# Altium project NB3000AL.PRJPCB (part 1 of 3)
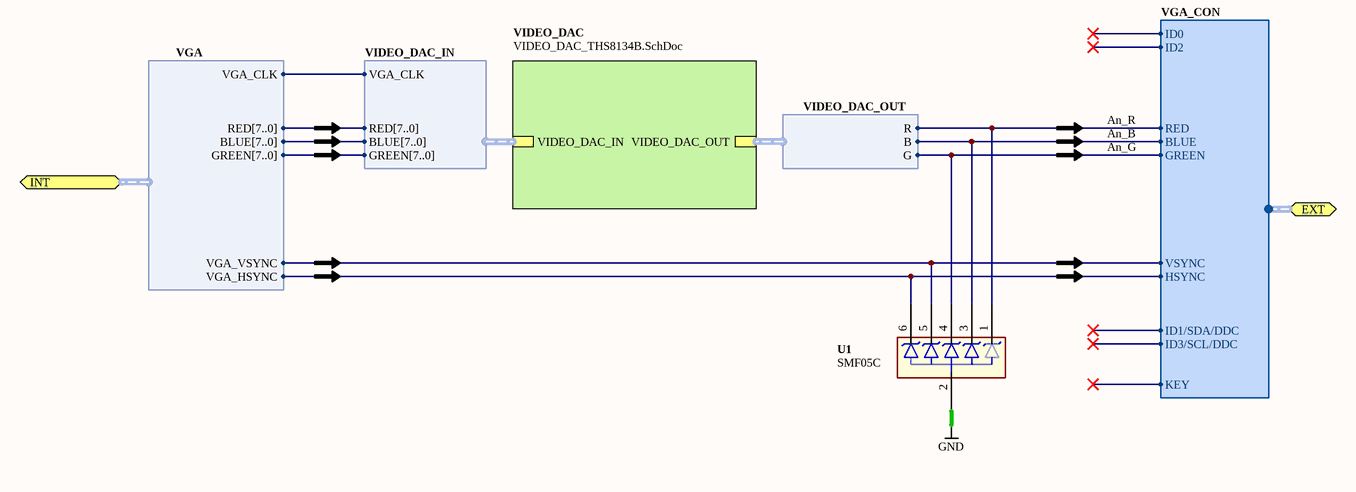
[diagram p0: VGA_OUT.SCHDOC]
ProjectAddress1: 3 Minna Close; ProjectAddress2: Belrose; ProjectAddress3: NSW 2085; ProjectAddress4: Australia; ProjectAssyNum: D-820-0053; ProjectOrganization: Altium Limited; ProjectRevision: 01; ProjectTitle: NB3000AL - Altera; ProjectTotalSheets: 106
22 sheets, 378 parts. Net scope: hierarchical (ports join the sheet entries above them; power ports are global).
Board files: NB3000AL.PcbDoc, NB3000AL_Panel.PcbDoc
Sheets:
  VGA_OUT.SCHDOC
  Audio_Codec.SchDoc
  PSU.SchDoc
  FPGA.SCHDOC
    USER_DECOUPLING_CAPS_3V3 = FPGA_Bypass_3V3.SCHDOC
    U_FPGA_Power = FPGA_NonIO.SchDoc
    PULLDOWN = PULLDNx3.SCHDOC
    PULLDOWN = PULLDNx3.SCHDOC
    PULLDOWN = PULLDNx3.SCHDOC
    PULLDOWN = PULLDNx3.SCHDOC
    PULLDOWN = PULLDNx3.SCHDOC
    PULLDOWN = PULLDNx3.SCHDOC
    PULLDOWN = PULLDNx3.SCHDOC
    PULLDOWN = PULLDNx3.SCHDOC
  LED_RGB_SMDx8.SCHDOC
    U_LED_01 = LED_RGB_SMDx2.SCHDOC
    U_LED_23 = LED_RGB_SMDx2.SCHDOC
    U_LED_45 = LED_RGB_SMDx2.SCHDOC
    U_LED_67 = LED_RGB_SMDx2.SCHDOC
  PWJACK+SWITCH.SchDoc
  HOST_JTAG.SchDoc
  USERPWR.SchDoc
  Host_FPGA.SchDoc
    HOST_NonIO = HOST_FPGA_NonIO.SchDoc
    HOST_DECOUPLING_CAPS_3V3 = FPGA_Bypass_3V3.SCHDOC
    PULLDOWN = PULLDNx3.SCHDOC
    PULLDOWN = PULLDNx3.SCHDOC
  USB_CY7C68001-56LFC.SchDoc
  OSC_24MHZ.SchDoc
  CON_AUDIO_AC99_NOMIC.SchDoc
  CON_FFC40_LCDTFT.SCHDOC
  Mounts.SchDoc
  PBCON.schdoc
  CON_SPDIF_INOUT_A.SchDoc
  USB_ISP1760.SchDoc

## Sheet VGA_OUT.SCHDOC: VGA Ouput
size A4; DocumentNumber: 2; PageSetup: Record=PageOptions|CenterHorizontal=True|CenterVertical=True|PrintScale=0.97|XCorrection=1.00|YCorrection=1.00|PrintKind=1|BorderSize=5000000|LeftOffset=0|BottomOffset=0|Orientation=2|PaperLength=1000|PaperWidth=1000|Scale=100|PaperSource=7|PrintQuality=-4|MediaType=1|DitherType=10|PaperKind=A4 (210 x 297 mm)|PrintScaleMode=1

### Parts
(Parts that share a designator on the sheet are numbered #1, #2 ... from top to bottom, then left to right.)
U1#1  SMF05C  [SC70_6L]

### Sub-sheets
VIDEO_DAC = VIDEO_DAC_THS8134B.SchDoc (file not in this document): VIDEO_DAC_OUT (harness VIDEO_DAC_OUT), VIDEO_DAC_IN (harness VIDEO_DAC_IN)

### Ports
EXT (harness VGA_CON), INT (harness VGA)

### Harnesses
VIDEO_DAC_IN: RED[7..0], GREEN[7..0], BLUE[7..0], VGA_CLK
VIDEO_DAC_OUT: B, R, G
VGA: RED[7..0], GREEN[7..0], BLUE[7..0], VGA_CLK, VGA_VSYNC, VGA_HSYNC
VGA_CON: RED, GREEN, BLUE, VSYNC, HSYNC, KEY, ID2, ID3/SCL/DDC, ID1/SDA/DDC, ID0

### Nets
GND: U1#1.2
An_B: U1#1.3 ; sheet VIDEO_DAC/VIDEO_DAC_OUT.B, port EXT.BLUE
An_G: U1#1.4 ; sheet VIDEO_DAC/VIDEO_DAC_OUT.G, port EXT.GREEN
An_R: U1#1.1 ; sheet VIDEO_DAC/VIDEO_DAC_OUT.R, port EXT.RED
NetU1#1_5: U1#1.5 ; port INT.VGA_VSYNC, port EXT.VSYNC
NetU1#1_6: U1#1.6 ; port INT.VGA_HSYNC, port EXT.HSYNC
(unnamed): sheet VIDEO_DAC/VIDEO_DAC_IN.VGA_CLK, port INT.VGA_CLK

### Notes on the sheet
- Sheet Title
- Project Title
- Size:
- Date:
- A4
- Assy:
- Time:
- Revision:
- Sheet
- of
- File:

### Library data of the parts
U1#1 = D-157-0000: TVS Diode Array  For ESD and Latch-Up Protection; Junction Capacitance: 130 pF; Peak Pulse Current: 8 A; Peak Pulse Power: 100 W; Reverse Breakdown Voltage: 6 V; Status: Unreleased; Category: Diode-Protection

## Sheet Audio_Codec.SchDoc: Audio CODEC Top
size A4; DocumentNumber: 4
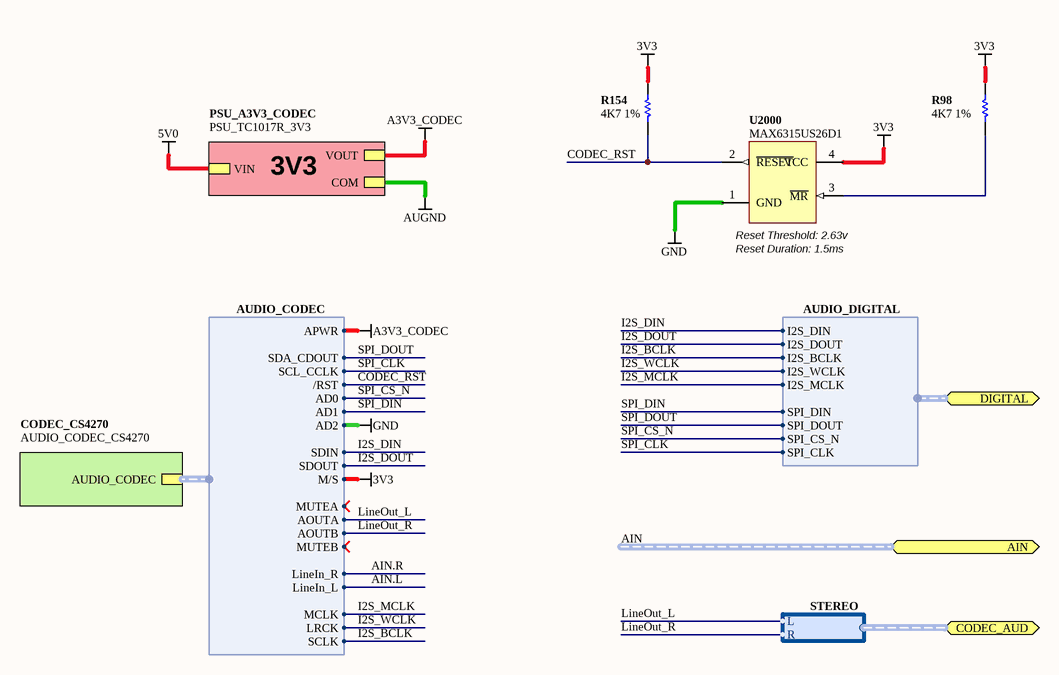
[diagram p1: Audio_Codec.SchDoc]

### Parts
(Parts that share a designator on the sheet are numbered #1, #2 ... from top to bottom, then left to right.)
R98  4K7 1%  [RESC1005-STAR]
R154#1  4K7 1%  [RESC1005-STAR]
U2000  MAX6315US26D1  [SOT143]

### Sub-sheets
CODEC_CS4270 = AUDIO_CODEC_CS4270 (file not in this document): AUDIO_CODEC (harness AUDIO_CODEC)
PSU_A3V3_CODEC = PSU_TC1017R_3V3 (file not in this document): VIN, VOUT, COM

### Ports
AIN (harness AUDIO_IN), CODEC_AUD (harness STEREO), DIGITAL (harness AUDIO_DIGITAL)

### Harnesses
AUDIO_CODEC: SDOUT, SDIN, SCLK, LRCK, MCLK, M/S, LineIn_L, LineIn_R, AOUTA, AOUTB, APWR, SCL_CCLK, AD1, SDA_CDOUT, AD0, AD2, /RST, MUTEA, MUTEB
AUDIO_DIGITAL: I2S_DOUT, I2S_DIN, I2S_BCLK, I2S_WCLK, I2S_MCLK, SPI_CLK, SPI_DIN, SPI_DOUT, SPI_CS_N
STEREO: L, R

### Nets
3V3: R98.2 R154#1.2 U2000.4(VCC) ; sheet CODEC_CS4270/AUDIO_CODEC.M/S
A3V3_CODEC: sheet PSU_A3V3_CODEC/VOUT, sheet CODEC_CS4270/AUDIO_CODEC.APWR
GND: U2000.1(GND) ; sheet CODEC_CS4270/AUDIO_CODEC.AD2
AIN.L: sheet CODEC_CS4270/AUDIO_CODEC.LineIn_L
AIN.R: sheet CODEC_CS4270/AUDIO_CODEC.LineIn_R
CODEC_RST: R154#1.1 U2000.2(~{RESET}) ; sheet CODEC_CS4270/AUDIO_CODEC./RST
I2S_BCLK: sheet CODEC_CS4270/AUDIO_CODEC.SCLK, port DIGITAL.I2S_BCLK
I2S_DIN: sheet CODEC_CS4270/AUDIO_CODEC.SDIN, port DIGITAL.I2S_DIN
I2S_DOUT: sheet CODEC_CS4270/AUDIO_CODEC.SDOUT, port DIGITAL.I2S_DOUT
I2S_MCLK: sheet CODEC_CS4270/AUDIO_CODEC.MCLK, port DIGITAL.I2S_MCLK
I2S_WCLK: sheet CODEC_CS4270/AUDIO_CODEC.LRCK, port DIGITAL.I2S_WCLK
LineOut_L: sheet CODEC_CS4270/AUDIO_CODEC.AOUTA, port CODEC_AUD.L
LineOut_R: sheet CODEC_CS4270/AUDIO_CODEC.AOUTB, port CODEC_AUD.R
SPI_CLK: sheet CODEC_CS4270/AUDIO_CODEC.SCL_CCLK, port DIGITAL.SPI_CLK
SPI_CS_N: sheet CODEC_CS4270/AUDIO_CODEC.AD0, port DIGITAL.SPI_CS_N
SPI_DIN: sheet CODEC_CS4270/AUDIO_CODEC.AD1, port DIGITAL.SPI_DIN
SPI_DOUT: sheet CODEC_CS4270/AUDIO_CODEC.SDA_CDOUT, port DIGITAL.SPI_DOUT
NetR98_1: R98.1 U2000.3(~{MR})

### Buses and harness runs
harness AIN = port AIN

### Notes on the sheet
- 3V3
- (near U2000) Reset Threshold: 2.63v
- (near U2000) Reset Duration: 1.5ms
- Sheet Title
- Project Title
- Size:
- Date:
- A4
- Assy:
- Time:
- Revision:
- Sheet
- of
- File:

### Library data of the parts
R98 R154#1 = D-100-0088: Resistor, 4K7 1% 0402 (1005); Power Rating: 63 mW; Resistance: 4.7 K; Category: Resistor; Mounting Technology: Surface Mount; Status: Production; Tolerance: 1 %
U2000 = D-243-0000: MAX6315, Open-Drain Output SOT Reset IC, Customized Reset Thresholds, Timeout Delays; Category: IC-Other; Status: Production

## Sheet PSU.SchDoc: NB3000 POWER SUPPLIES
size A4; Organization: Altium Limited.; DocumentNumber: 7; Revision: 6
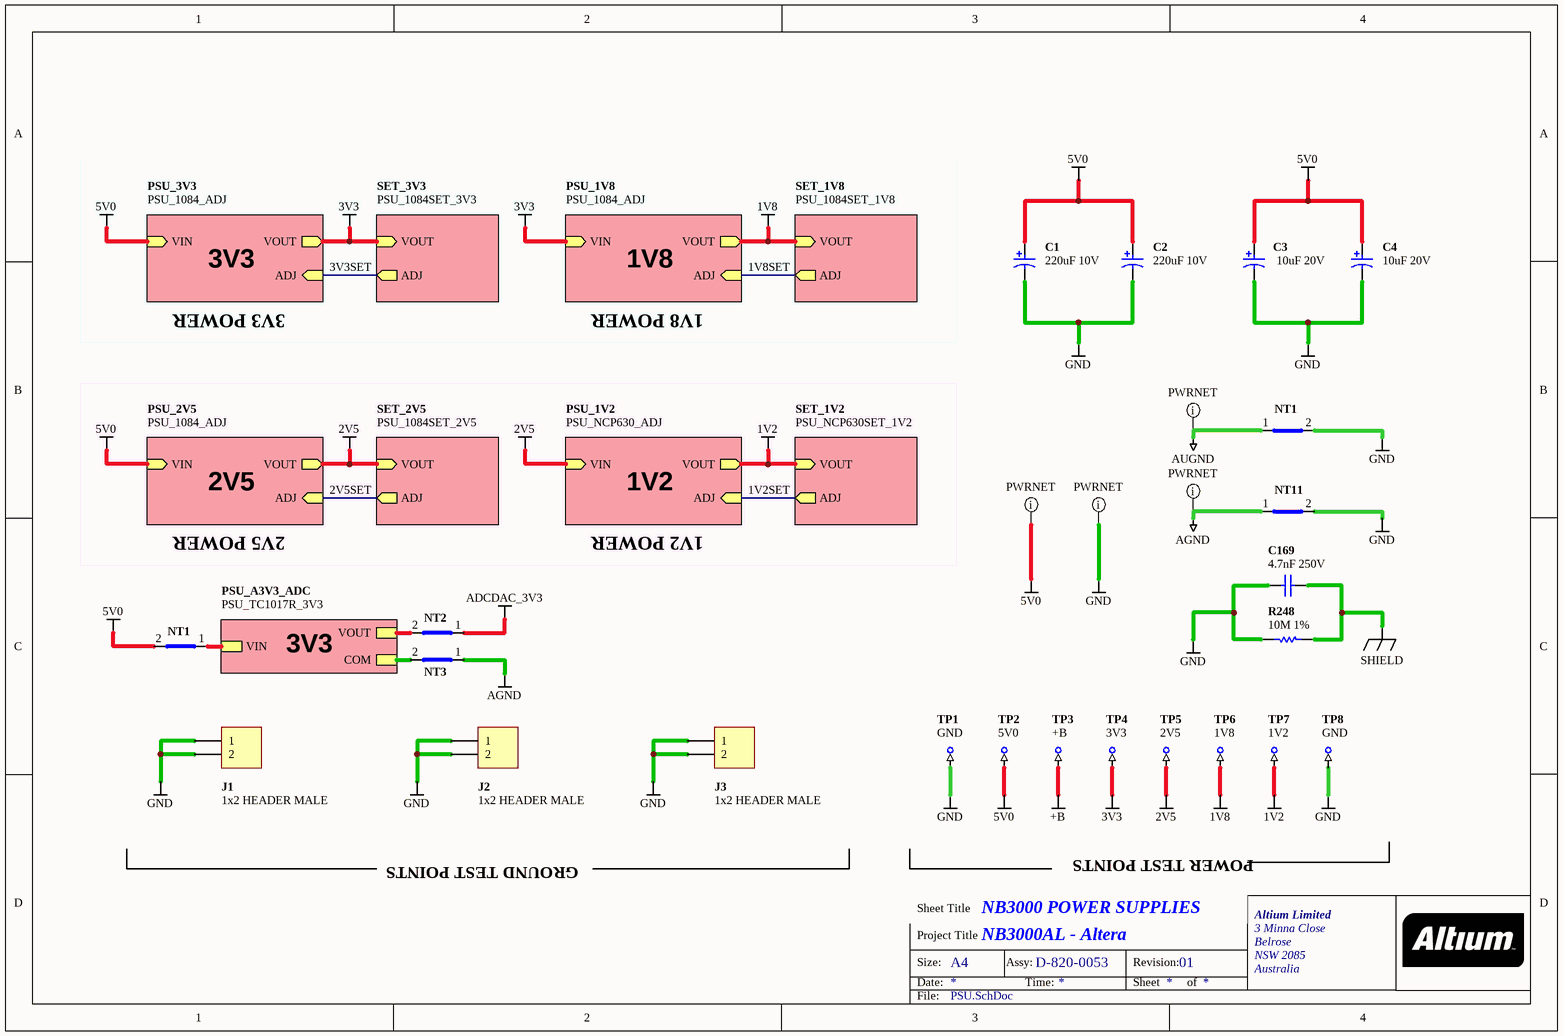
[diagram p2: PSU.SchDoc]

### Parts
(Parts that share a designator on the sheet are numbered #1, #2 ... from top to bottom, then left to right.)
C1#1  220uF 10V  [CAPC7343-STAR]
C2#1  220uF 10V  [CAPC7343-STAR]
C3#1  10uF 20V  [CAPC3528-STAR]
C4#1  10uF 20V  [CAPC3528-STAR]
C169  4.7nF 250V  [CAPM7163]
J1#1  1x2 HEADER MALE  [HDR1X2]
J2#1  1x2 HEADER MALE  [HDR1X2]
J3#1  1x2 HEADER MALE  [HDR1X2]
NT1#1  Net Tie SMT2  [NETTIE-SMT2-31X39]  (value not drawn)  (net tie, no BOM)
NT1#2  Net Tie SMT2  [NETTIE-SMT2-31X51]  (value not drawn)  (net tie, no BOM)
NT2#1  Net Tie SMT2  [NETTIE-SMT2-31X51]  (value not drawn)  (net tie, no BOM)
NT3#1  Net Tie SMT2  [NETTIE-SMT2-31X51]  (value not drawn)  (net tie, no BOM)
NT11  Net Tie SMT2  [NETTIE-SMT2-8X8]  (value not drawn)  (net tie, no BOM)
R248  10M 1%  [RESC3216]
TP1  GND  [TestPin]  (no BOM)
TP2  5V0  [TestPin]  (no BOM)
TP3  +B  [TestPin]  (no BOM)
TP4  3V3  [TestPin]  (no BOM)
TP5  2V5  [TestPin]  (no BOM)
TP6  1V8  [TestPin]  (no BOM)
TP7  1V2  [TestPin]  (no BOM)
TP8  GND  [TestPin]  (no BOM)

### Sub-sheets
PSU_1V2 = PSU_NCP630_ADJ (file not in this document): VIN (in), VOUT (out), ADJ (in)
PSU_1V8 = PSU_1084_ADJ (file not in this document): VIN (in), VOUT (out), ADJ (in)
PSU_2V5 = PSU_1084_ADJ (file not in this document): VIN (in), VOUT (out), ADJ (in)
PSU_3V3 = PSU_1084_ADJ (file not in this document): VIN (in), VOUT (out), ADJ (in)
PSU_A3V3_ADC = PSU_TC1017R_3V3 (file not in this document): VIN, VOUT, COM
SET_1V2 = PSU_NCP630SET_1V2 (file not in this document): VOUT (in), ADJ (out)
SET_1V8 = PSU_1084SET_1V8 (file not in this document): VOUT (in), ADJ (out)
SET_2V5 = PSU_1084SET_2V5 (file not in this document): VOUT (in), ADJ (out)
SET_3V3 = PSU_1084SET_3V3 (file not in this document): VOUT (in), ADJ (out)

### Nets
1V2: TP7.1 ; sheet PSU_1V2/VOUT, sheet SET_1V2/VOUT
1V8: TP6.1 ; sheet PSU_1V8/VOUT, sheet SET_1V8/VOUT
2V5: TP5.1 ; sheet PSU_1V2/VIN, sheet PSU_2V5/VOUT, sheet SET_2V5/VOUT
3V3: TP4.1 ; sheet PSU_1V8/VIN, sheet PSU_3V3/VOUT, sheet SET_3V3/VOUT
5V0: C1#1.1 C2#1.1 C3#1.1 C4#1.1 NT1#2.2(Net2) TP2.1 ; sheet PSU_2V5/VIN, sheet PSU_3V3/VIN
+B: TP3.1
ADCDAC_3V3: NT2#1.1(Net1)
AGND: NT3#1.1(Net1) NT11.1(Net1)
AUGND: NT1#1.1(Net1)
GND: C1#1.2 C2#1.2 C3#1.2 C4#1.2 C169.2 J1#1.1 J1#1.2 J2#1.1 J2#1.2 J3#1.1 J3#1.2 NT1#1.2(Net2) NT11.2(Net2) R248.2 TP1.1 TP8.1
SHIELD: C169.1 R248.1
1V2SET: sheet PSU_1V2/ADJ, sheet SET_1V2/ADJ
1V8SET: sheet PSU_1V8/ADJ, sheet SET_1V8/ADJ
2V5SET: sheet PSU_2V5/ADJ, sheet SET_2V5/ADJ
3V3SET: sheet PSU_3V3/ADJ, sheet SET_3V3/ADJ
NetNT1#2_1: NT1#2.1(Net1) ; sheet PSU_A3V3_ADC/VIN
NetNT2#1_2: NT2#1.2(Net2) ; sheet PSU_A3V3_ADC/VOUT
NetNT3#1_2: NT3#1.2(Net2) ; sheet PSU_A3V3_ADC/COM

### Layout directives
net class PWRNET: 5V0, AGND, AUGND, GND

### Notes on the sheet
- 3V3
- 3V3 POWER
- 1V8
- 1V8 POWER
- 2V5
- 1V2
- 2V5 POWER
- 1V2 POWER
- POWER TEST POINTS
- GROUND TEST POINTS
- Sheet Title
- Project Title
- Size:
- Date:
- A4
- Assy:
- Time:
- Revision:
- Sheet
- of
- File:

### Library data of the parts
C1#1 C2#1 = D-101-0088: Capacitor, Tantalum, 220uF 10% 10V MCCT-D (7343-31); Polarity: Polarized; Category: Capacitor; Capacitance: 220 uF; Mounting Technology: Surface Mount; Rated Voltage: 10 V; Status: Unreleased; Technology: Tantalum; Tolerance: 10 %
C3#1 C4#1 = D-101-0007: Capacitor, Tantalum, 10uF 10% 20V MCCT-B (3528); Polarity: Polarized; Category: Capacitor; Status: Production; Capacitance: 10 uF; Mounting Technology: Surface Mount; Rated Voltage: 20 V; Technology: Tantalum; Tolerance: 10 %
C169 = D-101-0019: Capacitor, Ceramic, 4.7nF 20% 250V Panasonic BC J Lead (CAPM7163) Y5V; Polarity: Non-Polarized; Tolerance: 20% %; Category: Capacitor; Capacitance: 4.7 nF; Dielectric: Y5V; Mounting Technology: Surface Mount; Rated Voltage: 250 V; Status: Production; Technology: Ceramic
J1#1 J2#1 J3#1 = D-300-0020: Header IDC, 2 x 1 Pin Vertical 2.54mm Pitch (Non-Boxed, Male); Max Current: 3 A; Category: Connector; Connector type: Header; Mounting Technology: Through-Hole; Pin Count: 2; Status: Production
NT1#1 NT11 = D-002-0004: Net-Tie, Surface Mount, 2 x 2.0mm x 0.8mm SMT Pads - For 0.8mm Track; Status: Production; Category: Net-Tie
NT1#2 NT2#1 NT3#1 = D-002-0003: Net-Tie, Surface Mount, 2 x 1.6mm x 0.8mm SMT Pads - For 0.8mm Track; Category: Net-Tie; Status: Production
R248 = D-100-0059: Resistor, 10M 1%1206 (3216); Power Rating: 250 mW; Category: Resistor; Mounting Technology: Surface Mount; Resistance: 10 M; Status: Deprecated; Tolerance: 1 %
TP1-TP8 = D-006-0000: Test Point, PCB Mount with Silkscreen Box; Category: Test-Point; Status: Production

## Sheet FPGA.SCHDOC: USER FPGA Connections
size A0; Organization: Altium Limited.; PageSetup: Record=PageOptions|CenterHorizontal=True|CenterVertical=True|PrintScale=0.50|XCorrection=1.00|YCorrection=1.00|PrintKind=0|BorderSize=5000000|LeftOffset=0|BottomOffset=0|Orientation=2|PaperLength=4199|PaperWidth=2969|Scale=100|PaperSource=7|PrintQuality=600|MediaType=1|DitherType=10|PaperKind=A3 (297 x 420 mm)|PrintScaleMode=1
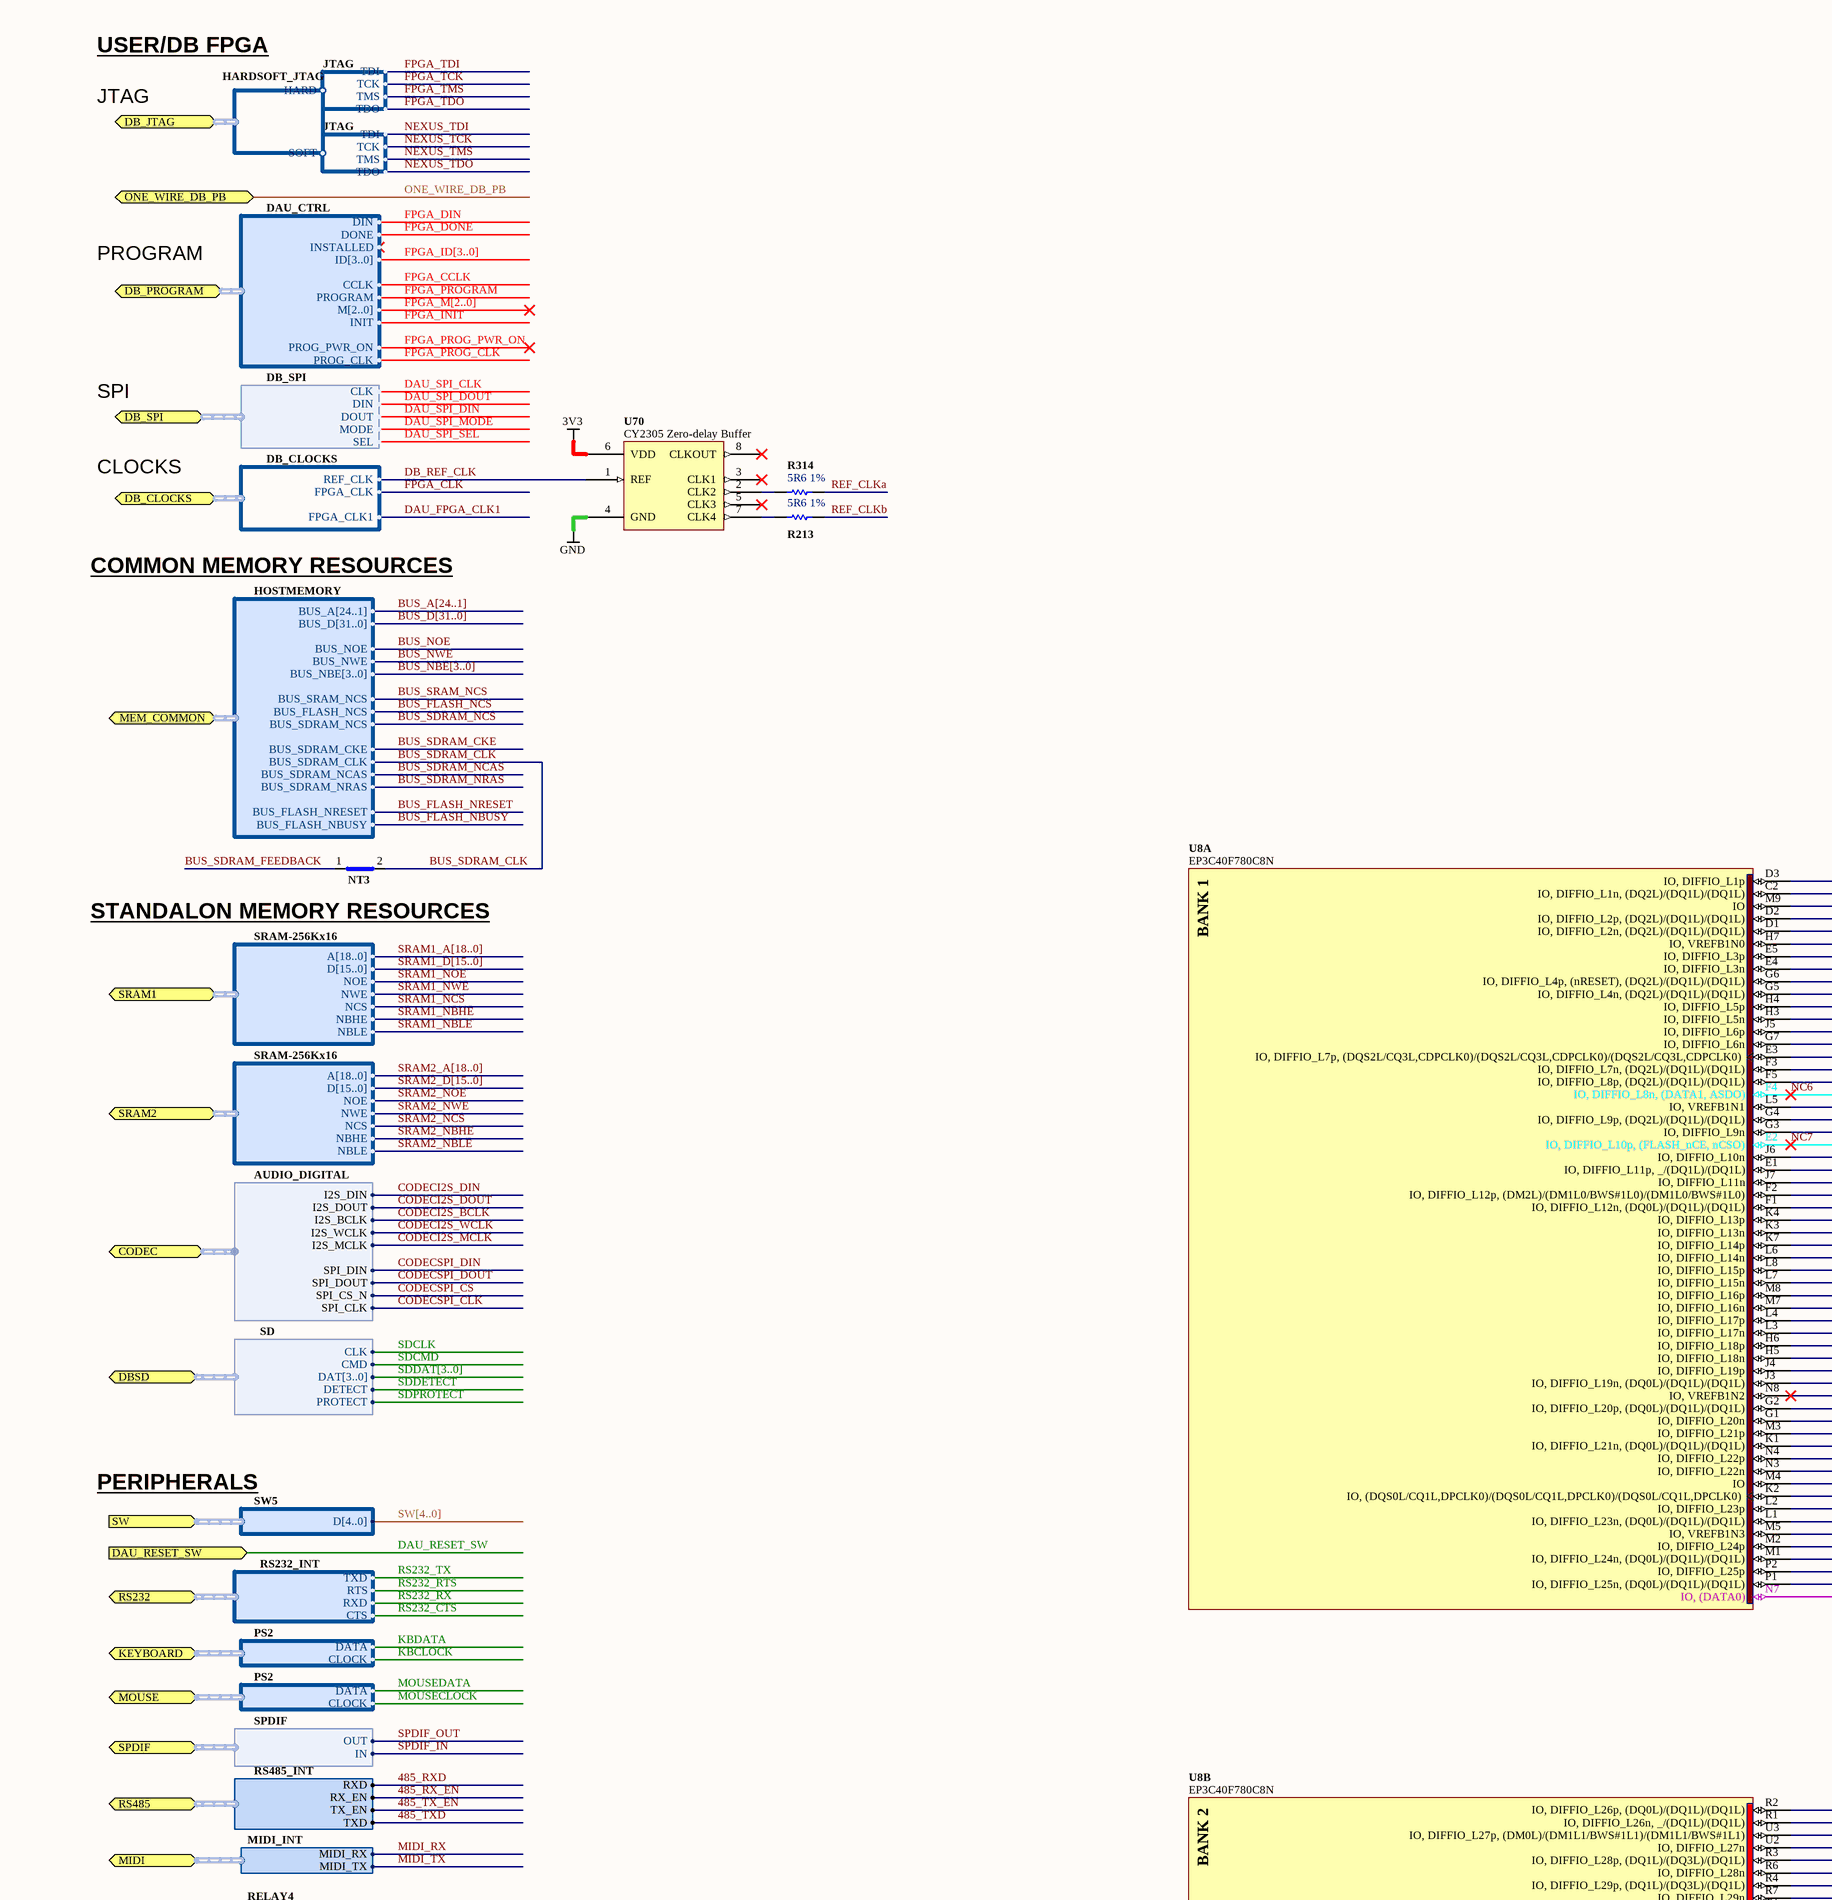
[diagram p3: FPGA.SCHDOC, top left]
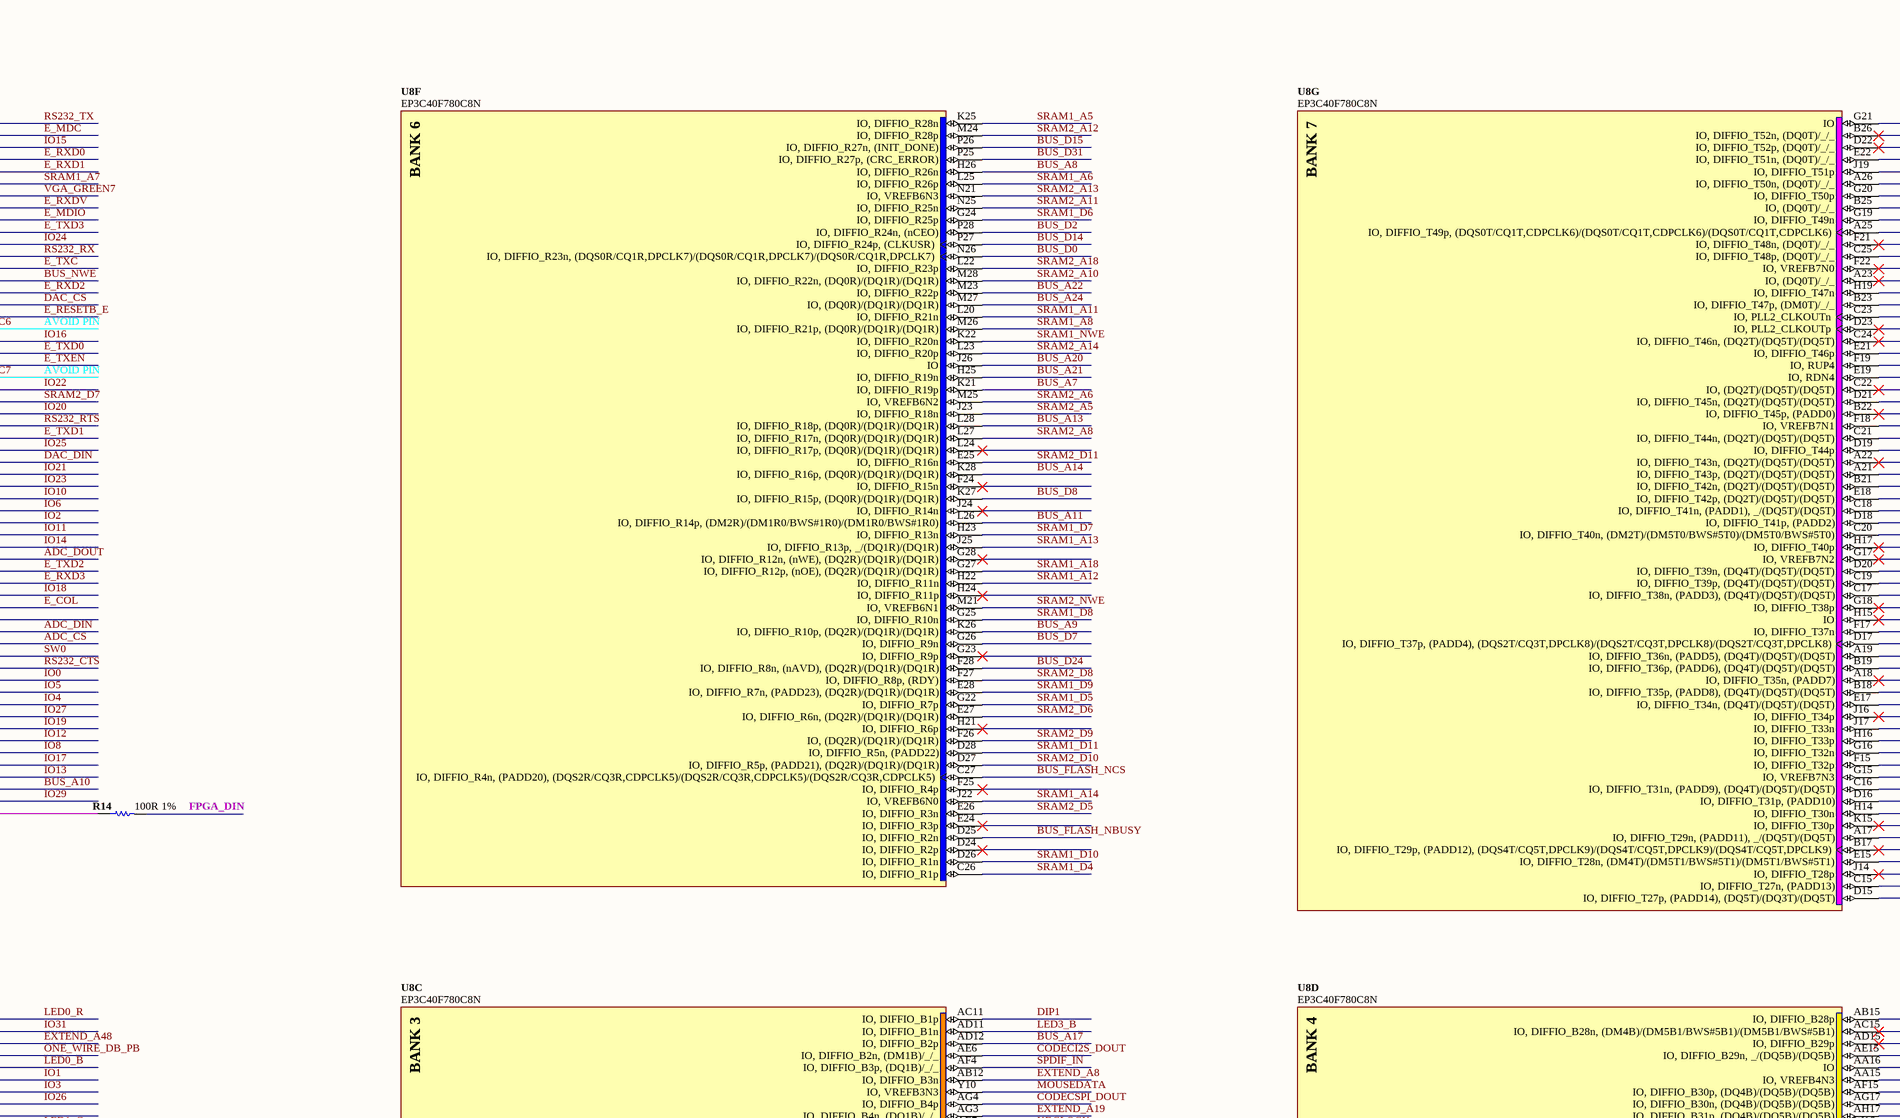
[diagram p4: FPGA.SCHDOC, top middle]
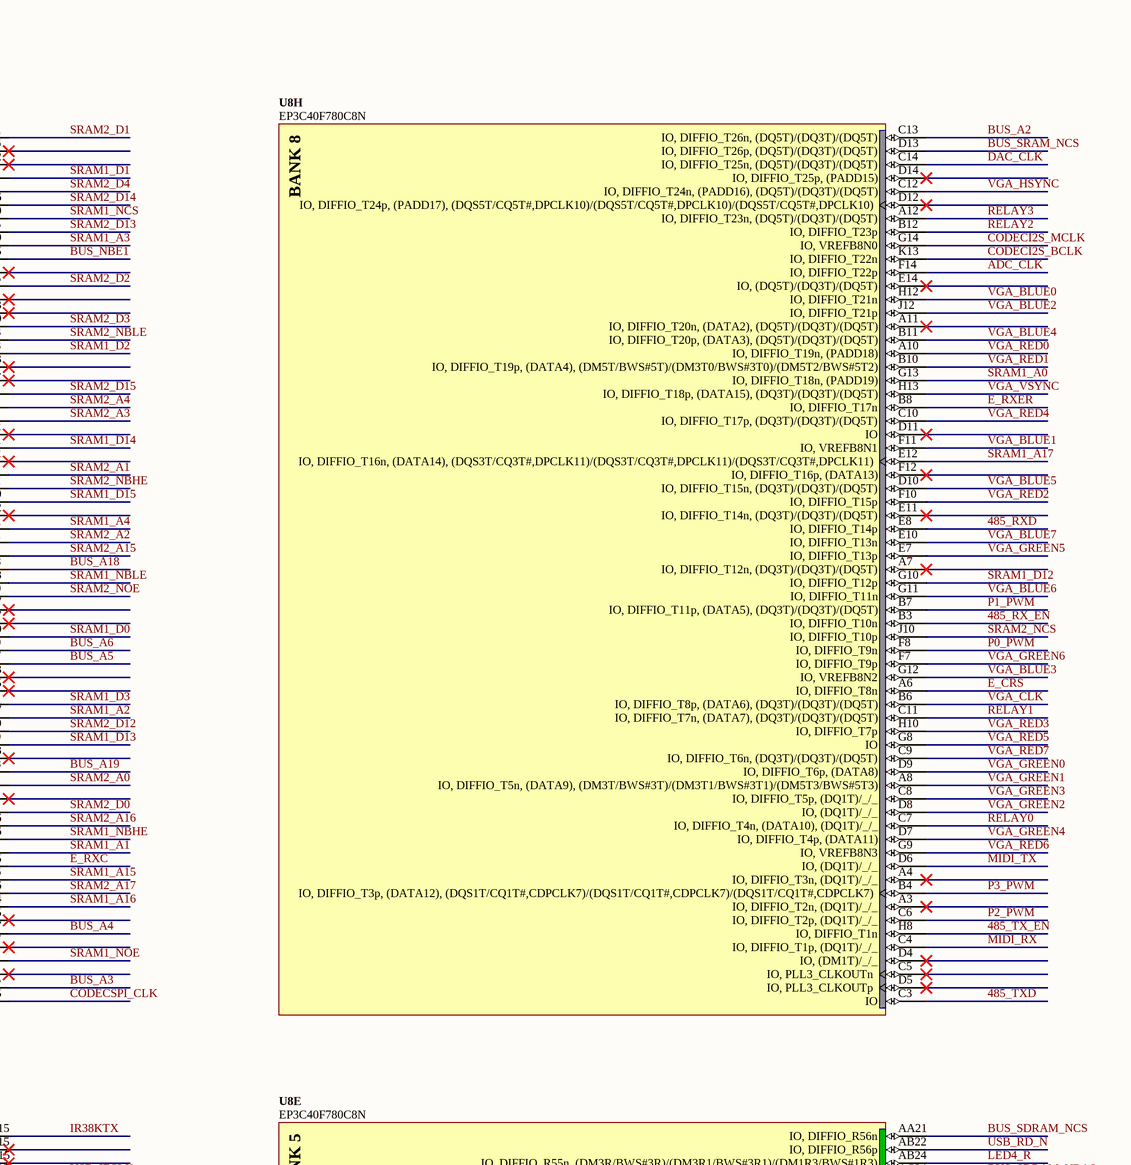
[diagram p5: FPGA.SCHDOC, top right]
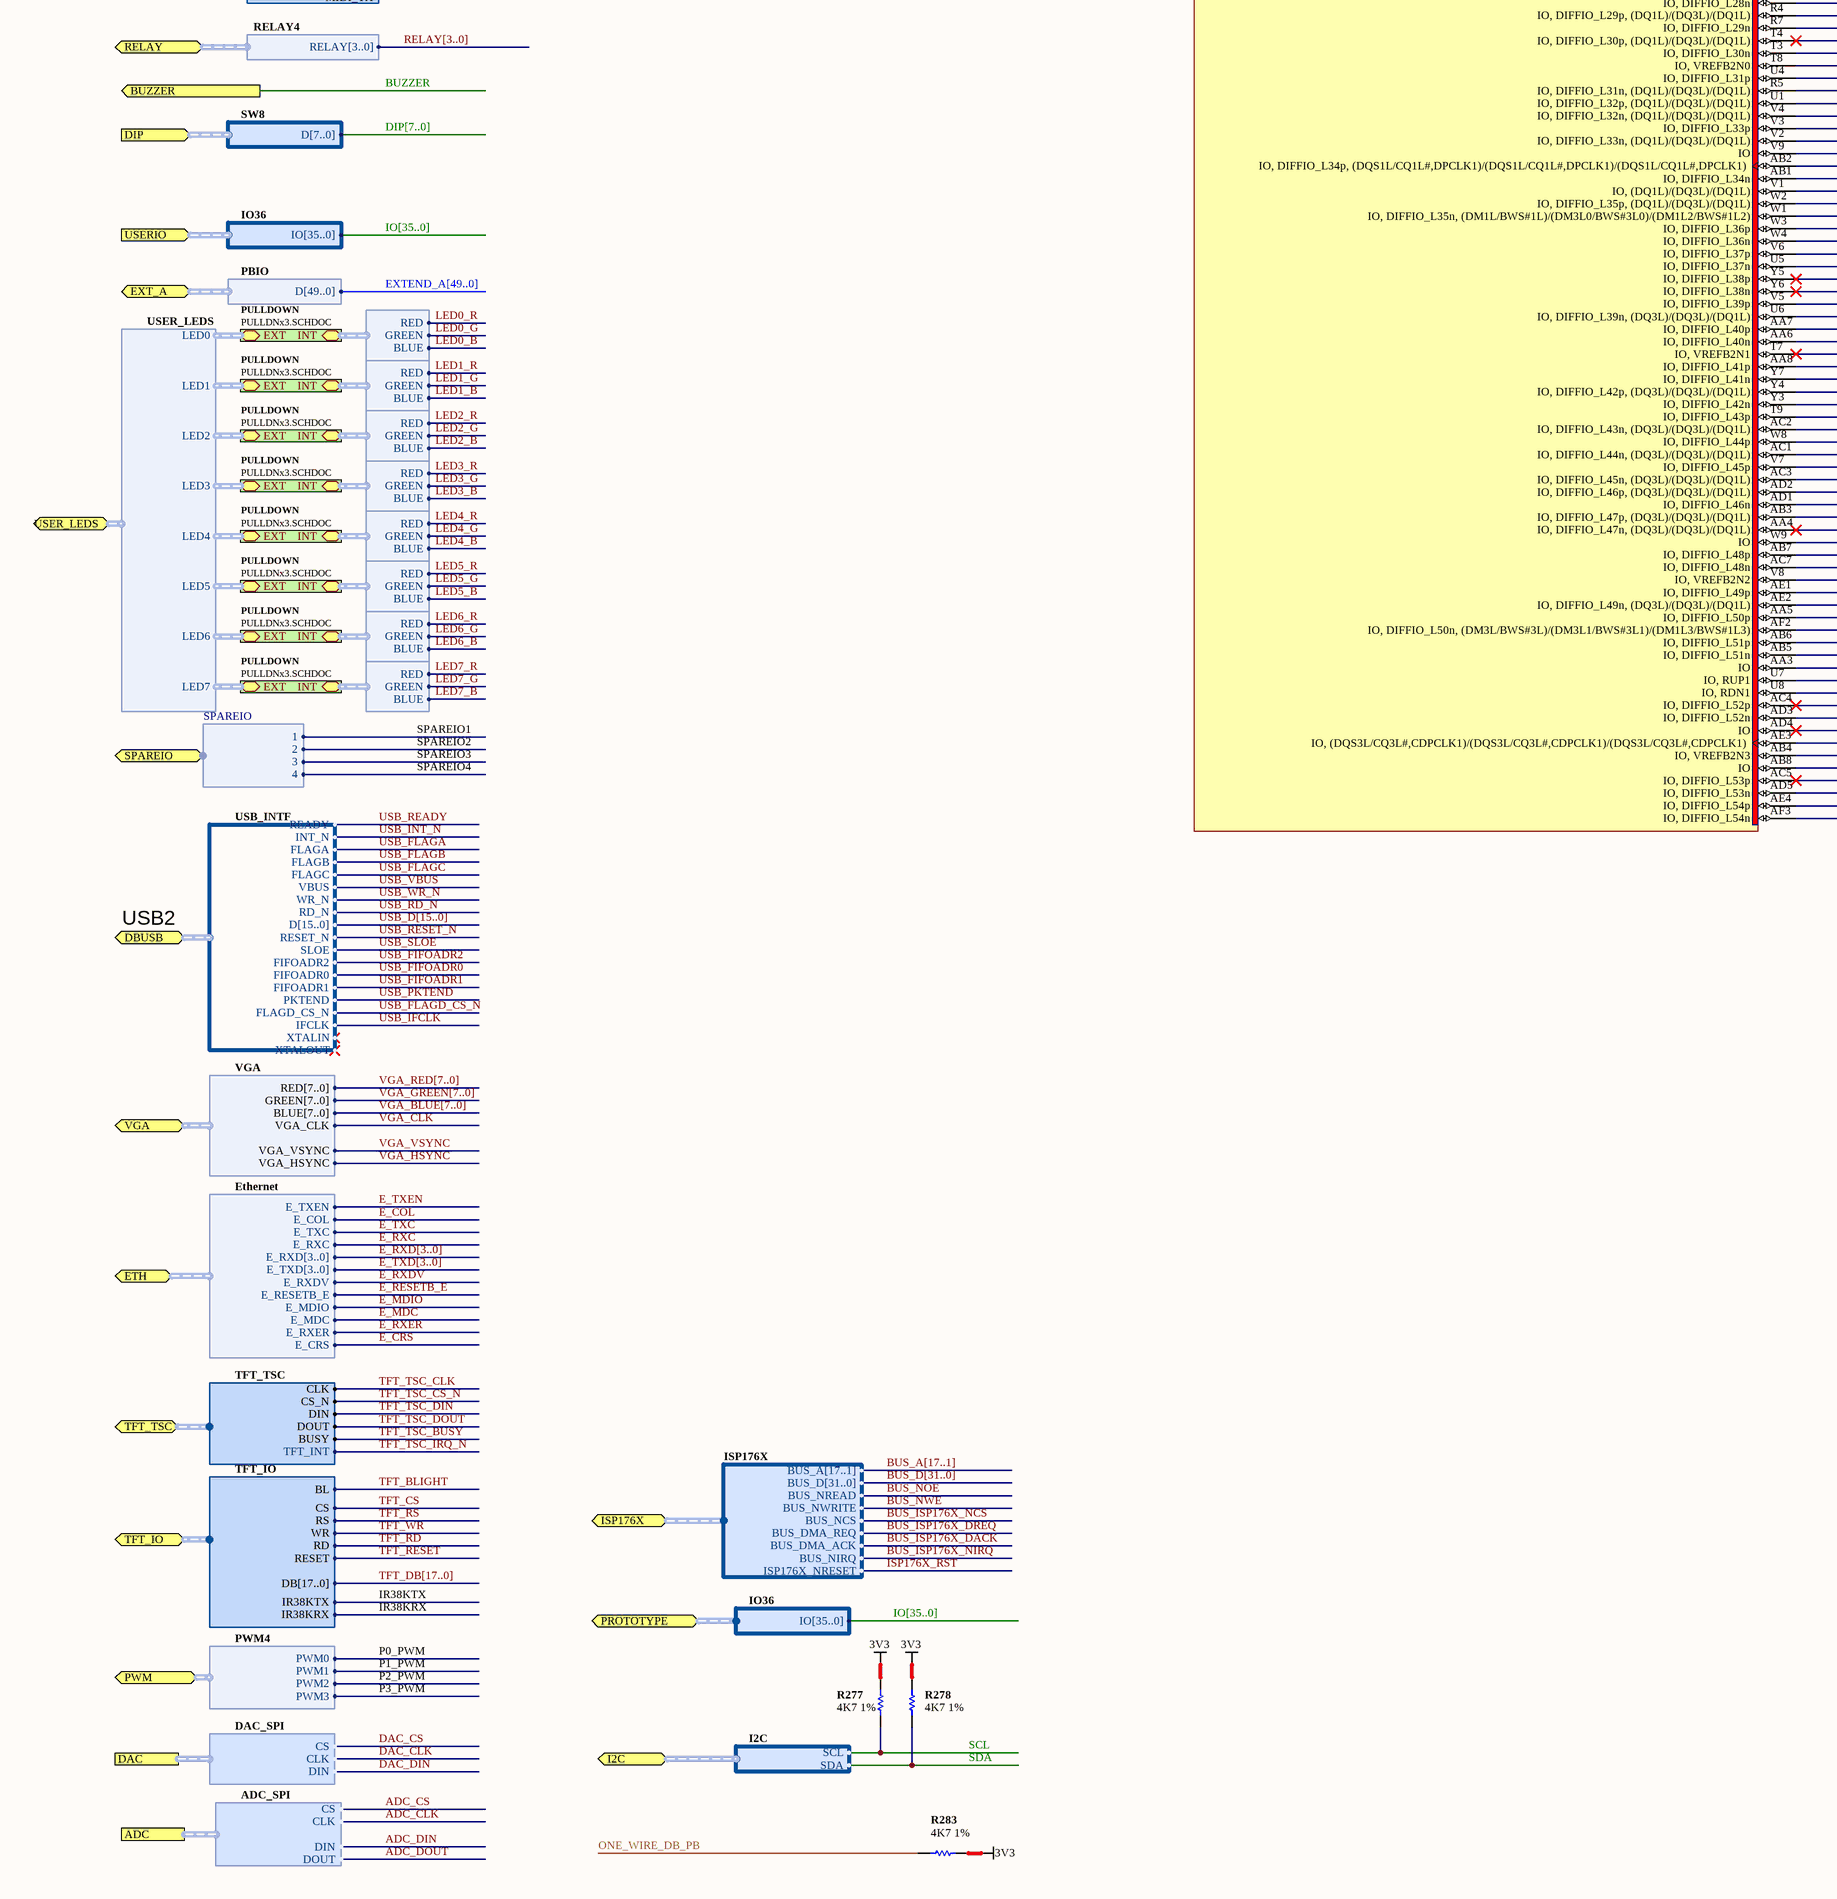
[diagram p6: FPGA.SCHDOC, bottom left]
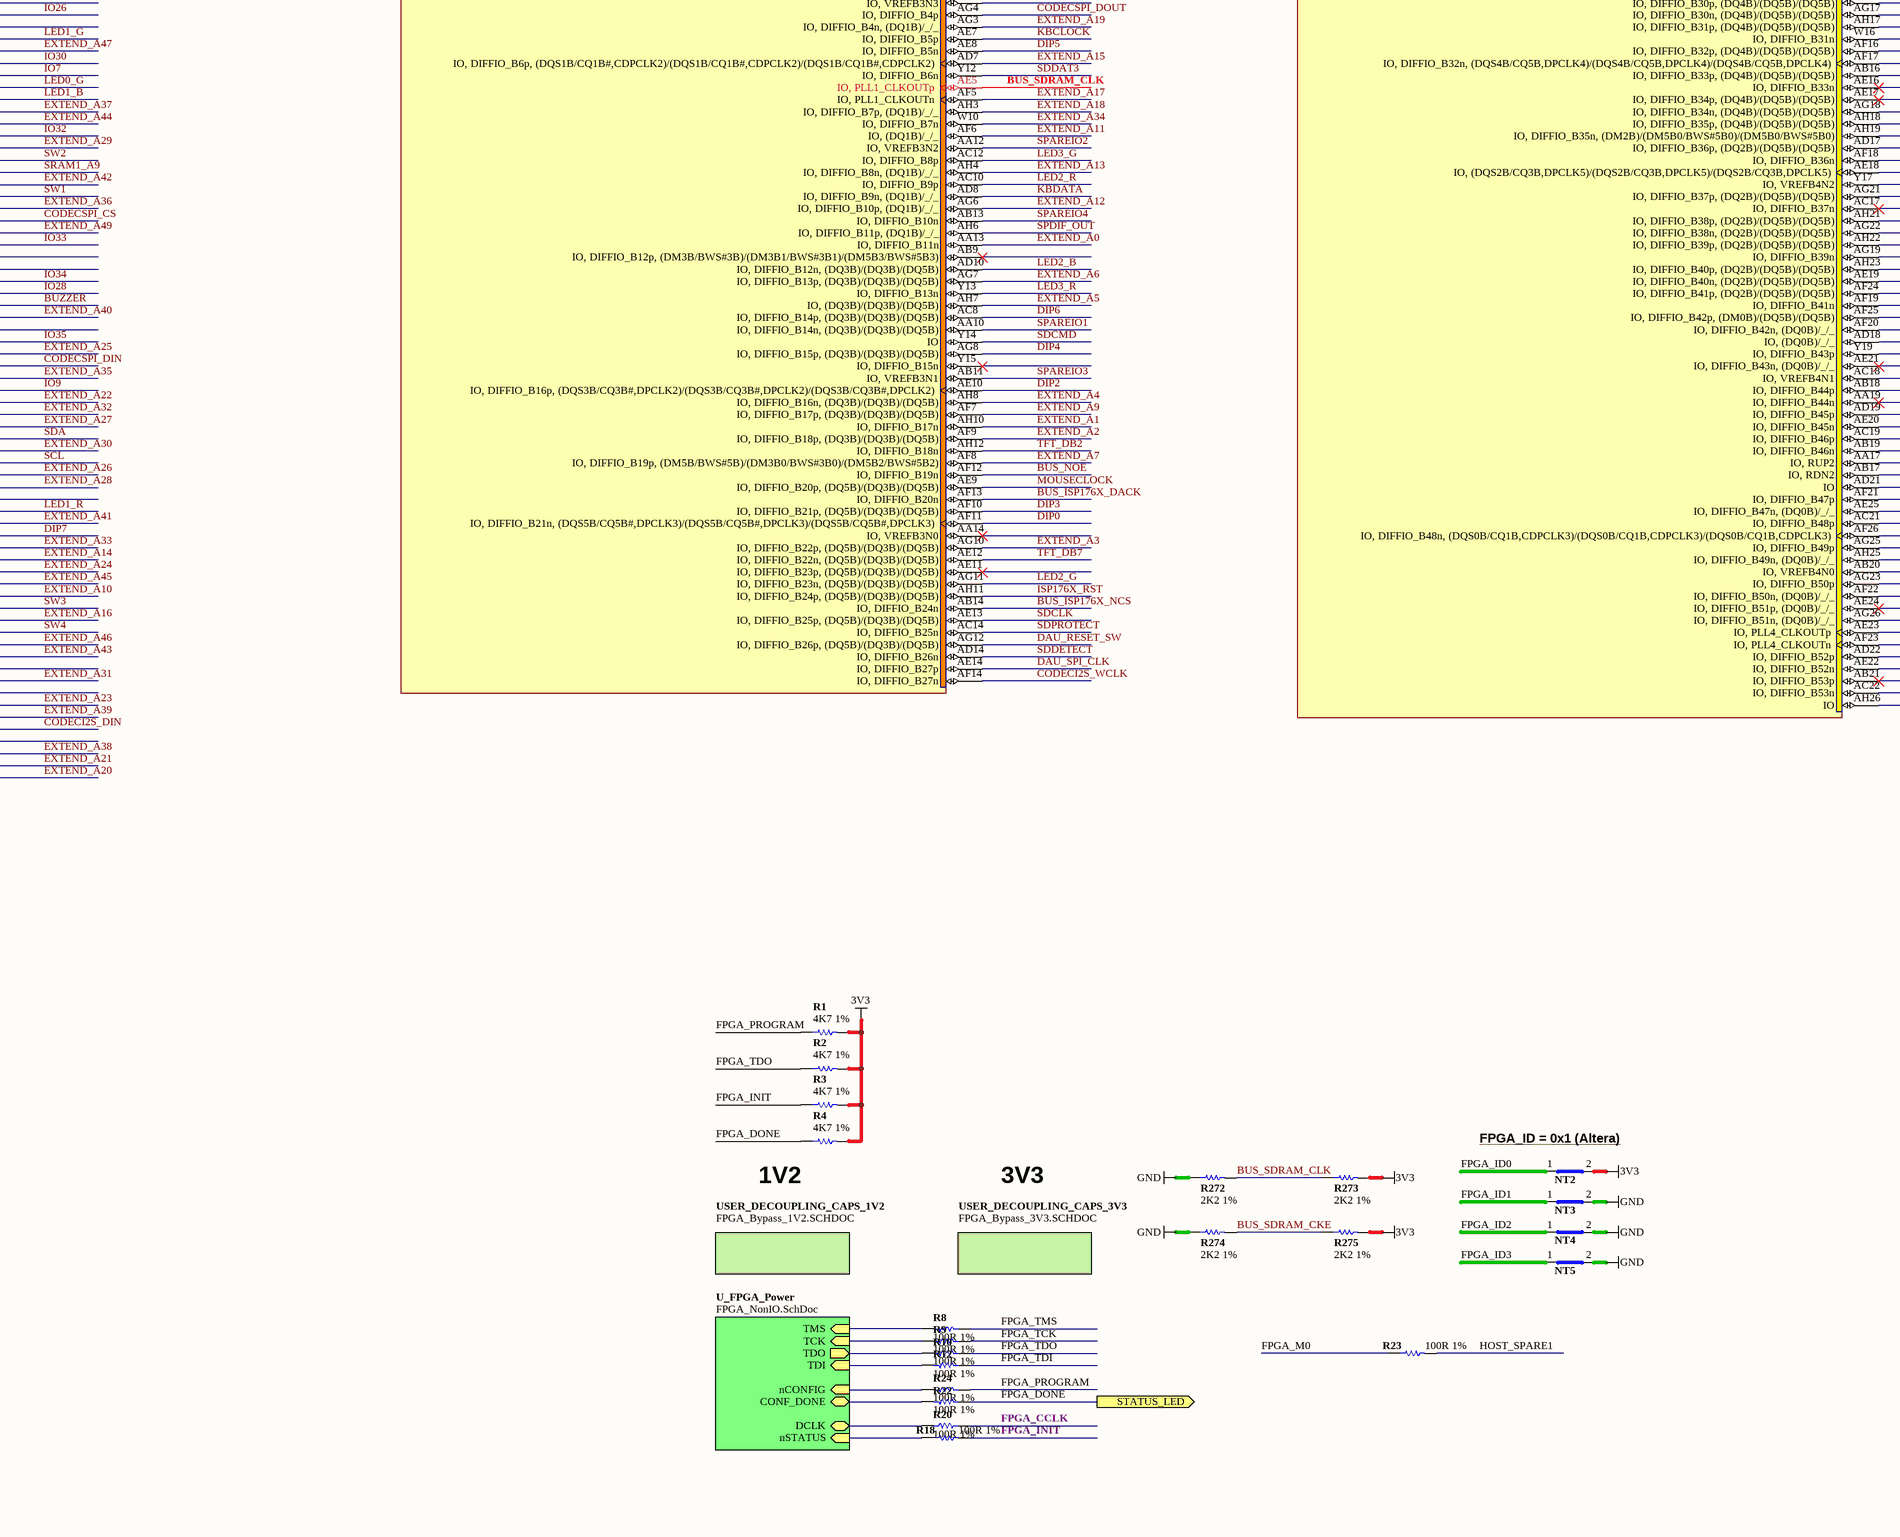
[diagram p7: FPGA.SCHDOC, bottom middle]
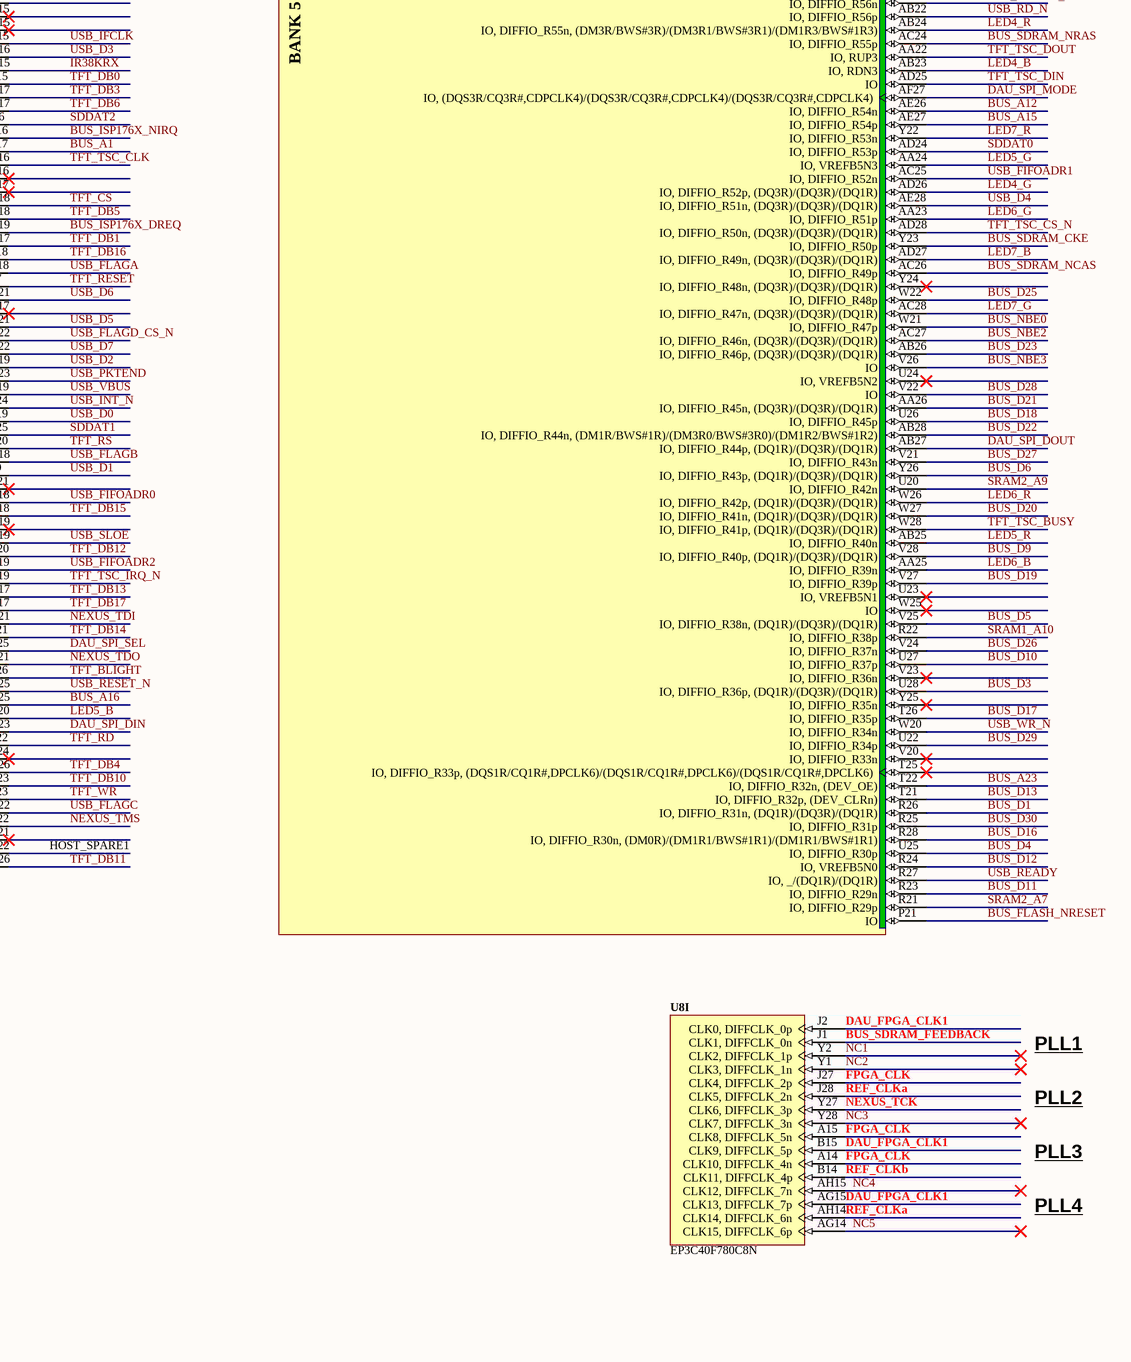
[diagram p8: FPGA.SCHDOC, bottom right]

### Parts
(Parts that share a designator on the sheet are numbered #1, #2 ... from top to bottom, then left to right.)
NT2#2  Net Tie SMT2  [NETTIE-SMT2-8X8]  (value not drawn)  (net tie, no BOM)
NT3#2  Net Tie SMT2  [NETTIE-SMT2-8X8]  (value not drawn)  (net tie, no BOM)
NT3#3  Net Tie SMT2  [NETTIE-SMT2-8X8]  (value not drawn)  (net tie, no BOM)
NT4  Net Tie SMT2  [NETTIE-SMT2-8X8]  (value not drawn)  (net tie, no BOM)
NT5  Net Tie SMT2  [NETTIE-SMT2-8X8]  (value not drawn)  (net tie, no BOM)
R1#1  4K7 1%  [RESC1005-STAR]
R2#1  4K7 1%  [RESC1005-STAR]
R3#1  4K7 1%  [RESC1005-STAR]
R4#1  4K7 1%  [RESC1005-STAR]
R8#1  100R 1%  [RESC1005-STAR]
R9#1  100R 1%  [RESC1005-STAR]
R10  100R 1%  [RESC1005-STAR]
R12  100R 1%  [RESC1005-STAR]
R14  100R 1%  [RESC1005-STAR]
R18  100R 1%  [RESC1005-STAR]
R20  100R 1%  [RESC1005-STAR]
R22  100R 1%  [RESC1005-STAR]
R23  100R 1%  [RESC1005-STAR]
R24  100R 1%  [RESC1005-STAR]
R213  5R6 1%  [RESC1005-STAR]
R272  2K2 1%  [RESC1005-STAR]
R273  2K2 1%  [RESC1005-STAR]
R274  2K2 1%  [RESC1005-STAR]
R275  2K2 1%  [RESC1005-STAR]
R277  4K7 1%  [RESC1005-STAR]
R278  4K7 1%  [RESC1005-STAR]
R283  4K7 1%  [RESC1005-STAR]
R314  5R6 1%  [RESC1005-STAR]
U8  EP3C40F780C8N  [FBGA780-2]  (parts A,B,C,D,E,F,G,H,I of 13)
U70  CY2305 Zero-delay Buffer  [SOIC127P600-8]

### Sub-sheets
PULLDOWN = PULLDNx3.SCHDOC: EXT, INT (harness RGB_LED)
PULLDOWN = PULLDNx3.SCHDOC: EXT, INT (harness RGB_LED)
PULLDOWN = PULLDNx3.SCHDOC: EXT, INT (harness RGB_LED)
PULLDOWN = PULLDNx3.SCHDOC: EXT, INT (harness RGB_LED)
PULLDOWN = PULLDNx3.SCHDOC: EXT, INT (harness RGB_LED)
PULLDOWN = PULLDNx3.SCHDOC: EXT, INT (harness RGB_LED)
PULLDOWN = PULLDNx3.SCHDOC: EXT, INT (harness RGB_LED)
PULLDOWN = PULLDNx3.SCHDOC: EXT, INT (harness RGB_LED)
U_FPGA_Power = FPGA_NonIO.SchDoc: TMS (in), CONF_DONE (bidir), DCLK (bidir), TCK (in), nSTATUS (in), TDI (in), nCONFIG (in), TDO (out)
USER_DECOUPLING_CAPS_1V2 = FPGA_Bypass_1V2.SCHDOC (file not in this document): no entries
USER_DECOUPLING_CAPS_3V3 = FPGA_Bypass_3V3.SCHDOC: no entries

### Ports
ADC (harness ADC_SPI), BUZZER (out), CODEC (harness AUDIO_DIGITAL), DAC (harness DAC_SPI), DAU_RESET_SW (in), DB_CLOCKS (harness DB_CLOCKS), DB_JTAG (harness HARDSOFT_JTAG), DB_PROGRAM (harness DAU_CTRL), DB_SPI (harness DB_SPI), DBSD (harness SD), DBUSB (harness USB_INTF), DIP (harness SW8), ETH (harness Ethernet), EXT_A (harness PBIO), I2C (harness I2C), ISP176X (harness ISP176X), KEYBOARD (harness PS2), MEM_COMMON (harness HOSTMEMORY), MIDI (harness MIDI_INT), MOUSE (harness PS2), ONE_WIRE_DB_PB (bidir), PROTOTYPE (harness IO36), PWM (harness PWM4), RELAY (harness RELAY4), RS232 (harness RS232_INT), RS485 (harness RS485_INT), SPAREIO (harness SPAREIO), SPDIF (harness SPDIF), SRAM1 (harness SRAM-256Kx16), SRAM2 (harness SRAM-256Kx16), STATUS_LED (out), SW (harness SW5), TFT_IO (harness TFT_IO), TFT_TSC (harness TFT_TSC), USER_LEDS (harness USER_LEDS), USERIO (harness IO36), VGA (harness VGA)

### Harnesses
SRAM-256Kx16: A[18..0], D[15..0], NCS, NWE, NOE, NBHE, NBLE
HOSTMEMORY: BUS_A[24..1], BUS_D[31..0], BUS_NOE, BUS_NWE, BUS_NBE[3..0], BUS_SRAM_NCS, BUS_FLASH_NCS, BUS_SDRAM_NCS, BUS_SDRAM_CKE, BUS_SDRAM_CLK, BUS_SDRAM_NCAS, BUS_SDRAM_NRAS, BUS_FLASH_NRESET, BUS_FLASH_NBUSY
DAU_CTRL: DIN, DONE, INSTALLED, ID[3..0], CCLK, PROGRAM, M[2..0], INIT, PROG_PWR_ON, PROG_CLK
SW5: D[4..0]
PS2: DATA, CLOCK
RS232_INT: RXD, TXD, RTS, CTS
IO36: IO[35..0]
I2C: SCL, SDA
RGB_LED: GREEN, RED, BLUE
AUDIO_DIGITAL: I2S_DOUT, I2S_DIN, I2S_BCLK, I2S_WCLK, I2S_MCLK, SPI_CLK, SPI_DIN, SPI_DOUT, SPI_CS_N
SW8: D[7..0]
SD: CLK, CMD, DAT[3..0], DETECT, PROTECT
Ethernet: E_RXC, E_TXC, E_TXD[3..0], E_TXEN, E_COL, E_RXD[3..0], E_RXDV, E_RESETB_E, E_MDIO, E_MDC, E_RXER, E_CRS
SPDIF: IN, OUT
VGA: RED[7..0], GREEN[7..0], BLUE[7..0], VGA_CLK, VGA_VSYNC, VGA_HSYNC
RELAY4: RELAY[3..0]
ADC_SPI: CS, CLK, DIN, DOUT
DAC_SPI: CS, CLK, DIN
MIDI_INT: MIDI_TX, MIDI_RX
JTAG: TMS, TDO, TDI, TCK
HARDSOFT_JTAG: HARD, SOFT
DB_CLOCKS: REF_CLK, FPGA_CLK, FPGA_CLK1
PWM4: PWM0, PWM1, PWM2, PWM3
RS485_INT: TX_EN, RXD, RX_EN, TXD
DB_SPI: MODE, SEL, CLK, DIN, DOUT
TFT_IO: CS, RS, WR, RD, RESET, DB[17..0], BL, IR38KTX, IR38KRX
USER_LEDS: LED0, LED1, LED2, LED3, LED4, LED5, LED6, LED7
PBIO: D[49..0]
USB_INTF: READY, INT_N, SLOE, FIFOADR2, FIFOADR0, FIFOADR1, PKTEND, FLAGD_CS_N, FLAGA, FLAGB, FLAGC, WR_N, RD_N, D[15..0], RESET_N, IFCLK, XTALIN, VBUS, XTALOUT
ISP176X: BUS_A[17..1], BUS_D[31..0], BUS_NREAD, BUS_NCS, BUS_DMA_REQ, BUS_DMA_ACK, BUS_NIRQ, BUS_NWRITE, ISP176X_NRESET
SPAREIO: 1, 2, 3, 4
TFT_TSC: CLK, CS_N, DIN, DOUT, BUSY, TFT_INT

### Nets
3V3: NT2#2.2(Net2) R1#1.2 R2#1.2 R3#1.2 R4#1.2 R273.2 R275.2 R277.1 R278.2 R283.1 U70.6(VDD)
GND: NT3#3.2(Net2) NT4.2(Net2) NT5.2(Net2) R272.1 R274.1 U70.4(GND)
485_RX_EN: U8.B3(IO,_DIFFIO_T10n) ; port RS485.RX_EN
485_RXD: U8.E8(IO,_DIFFIO_T14p) ; port RS485.RXD
485_TX_EN: U8.H8(IO,_DIFFIO_T1n) ; port RS485.TX_EN
485_TXD: U8.C3(IO) ; port RS485.TXD
ADC_CLK: U8.F14(IO,_DIFFIO_T22p) ; port ADC.CLK
ADC_CS: U8.G1(IO,_DIFFIO_L20n) ; port ADC.CS
ADC_DIN: U8.G2(IO,_DIFFIO_L20p,_(DQ0L)/(DQ1L)/(DQ1L)) ; port ADC.DIN
ADC_DOUT: U8.L3(IO,_DIFFIO_L17n) ; port ADC.DOUT
BUS_A1: U8.AF17(IO,_DIFFIO_B32n,_(DQS4B/CQ5B,DPCLK4)/(DQS4B/CQ5B,DPCLK4)/(DQS4B/CQ5B,DPCLK4))
BUS_A2: U8.C13(IO,_DIFFIO_T26n,_(DQ5T)/(DQ3T)/(DQ5T))
BUS_A3: U8.C15(IO,_DIFFIO_T27n,_(PADD13))
BUS_A4: U8.A17(IO,_DIFFIO_T29n,_(PADD11),__/(DQ5T)/(DQ5T))
BUS_A5: U8.C17(IO,_DIFFIO_T38n,_(PADD3),_(DQ4T)/(DQ5T)/(DQ5T))
BUS_A6: U8.C19(IO,_DIFFIO_T39p,_(DQ4T)/(DQ5T)/(DQ5T))
BUS_A7: U8.K21(IO,_DIFFIO_R19p)
BUS_A8: U8.H26(IO,_DIFFIO_R26n)
BUS_A9: U8.K26(IO,_DIFFIO_R10p,_(DQ2R)/(DQ1R)/(DQ1R))
BUS_A10: U8.P2(IO,_DIFFIO_L25p)
BUS_A11: U8.L26(IO,_DIFFIO_R14p,_(DM2R)/(DM1R0/BWS#1R0)/(DM1R0/BWS#1R0))
BUS_A12: U8.AE26(IO,_DIFFIO_R54n)
BUS_A13: U8.L28(IO,_DIFFIO_R18p,_(DQ0R)/(DQ1R)/(DQ1R))
BUS_A14: U8.K28(IO,_DIFFIO_R16p,_(DQ0R)/(DQ1R)/(DQ1R))
BUS_A15: U8.AE27(IO,_DIFFIO_R54p)
BUS_A16: U8.AH25(IO,_DIFFIO_B49n,_(DQ0B)/_/_)
BUS_A17: U8.AD12(IO,_DIFFIO_B2p)
BUS_A18: U8.C18(IO,_DIFFIO_T41n,_(PADD1),__/(DQ5T)/(DQ5T))
BUS_A19: U8.B18(IO,_DIFFIO_T35p,_(PADD8),_(DQ4T)/(DQ5T)/(DQ5T))
BUS_A20: U8.J26(IO)
BUS_A21: U8.H25(IO,_DIFFIO_R19n)
BUS_A22: U8.M23(IO,_DIFFIO_R22p)
BUS_A23: U8.T22(IO,_DIFFIO_R32n,_(DEV_OE))
BUS_A24: U8.M27(IO,_(DQ0R)/(DQ1R)/(DQ1R))
BUS_D0: U8.N26(IO,_DIFFIO_R23n,_(DQS0R/CQ1R,DPCLK7)/(DQS0R/CQ1R,DPCLK7)/(DQS0R/CQ1R,DPCLK7))
BUS_D1: U8.R26(IO,_DIFFIO_R31n,_(DQ1R)/(DQ3R)/(DQ1R))
BUS_D2: U8.P28(IO,_DIFFIO_R24n,_(nCEO))
BUS_D3: U8.U28(IO,_DIFFIO_R36p,_(DQ1R)/(DQ3R)/(DQ1R))
BUS_D4: U8.U25(IO,_DIFFIO_R30p)
BUS_D5: U8.V25(IO,_DIFFIO_R38n,_(DQ1R)/(DQ3R)/(DQ1R))
BUS_D6: U8.Y26(IO,_DIFFIO_R43p,_(DQ1R)/(DQ3R)/(DQ1R))
BUS_D7: U8.G26(IO,_DIFFIO_R9n)
BUS_D8: U8.K27(IO,_DIFFIO_R15p,_(DQ0R)/(DQ1R)/(DQ1R))
BUS_D9: U8.V28(IO,_DIFFIO_R40p,_(DQ1R)/(DQ3R)/(DQ1R))
BUS_D10: U8.U27(IO,_DIFFIO_R37p)
BUS_D11: U8.R23(IO,_DIFFIO_R29n)
BUS_D12: U8.R24(IO,_VREFB5N0)
BUS_D13: U8.T21(IO,_DIFFIO_R32p,_(DEV_CLRn))
BUS_D14: U8.P27(IO,_DIFFIO_R24p,_(CLKUSR))
BUS_D15: U8.P26(IO,_DIFFIO_R27n,_(INIT_DONE))
BUS_D16: U8.R28(IO,_DIFFIO_R30n,_(DM0R)/(DM1R1/BWS#1R1)/(DM1R1/BWS#1R1))
BUS_D17: U8.T26(IO,_DIFFIO_R35p)
BUS_D18: U8.U26(IO,_DIFFIO_R45p)
BUS_D19: U8.V27(IO,_DIFFIO_R39p)
BUS_D20: U8.W27(IO,_DIFFIO_R41n,_(DQ1R)/(DQ3R)/(DQ1R))
BUS_D21: U8.AA26(IO,_DIFFIO_R45n,_(DQ3R)/(DQ3R)/(DQ1R))
BUS_D22: U8.AB28(IO,_DIFFIO_R44n,_(DM1R/BWS#1R)/(DM3R0/BWS#3R0)/(DM1R2/BWS#1R2))
BUS_D23: U8.AB26(IO,_DIFFIO_R46p,_(DQ3R)/(DQ3R)/(DQ1R))
BUS_D24: U8.F28(IO,_DIFFIO_R8n,_(nAVD),_(DQ2R)/(DQ1R)/(DQ1R))
BUS_D25: U8.W22(IO,_DIFFIO_R48p)
BUS_D26: U8.V24(IO,_DIFFIO_R37n)
BUS_D27: U8.V21(IO,_DIFFIO_R43n)
BUS_D28: U8.V22(IO)
BUS_D29: U8.U22(IO,_DIFFIO_R34p)
BUS_D30: U8.R25(IO,_DIFFIO_R31p)
BUS_D31: U8.P25(IO,_DIFFIO_R27p,_(CRC_ERROR))
BUS_FLASH_NBUSY: U8.D25(IO,_DIFFIO_R2n) ; port MEM_COMMON.BUS_FLASH_NBUSY
BUS_FLASH_NCS: U8.C27(IO,_DIFFIO_R4n,_(PADD20),_(DQS2R/CQ3R,CDPCLK5)/(DQS2R/CQ3R,CDPCLK5)/(DQS2R/CQ3R,CDPCLK5)) ; port MEM_COMMON.BUS_FLASH_NCS
BUS_FLASH_NRESET: U8.P21(IO) ; port MEM_COMMON.BUS_FLASH_NRESET
BUS_ISP176X_DACK: U8.AF13(IO,_DIFFIO_B20n) ; port ISP176X.BUS_DMA_ACK
BUS_ISP176X_DREQ: U8.AH19(IO,_DIFFIO_B35n,_(DM2B)/(DM5B0/BWS#5B0)/(DM5B0/BWS#5B0)) ; port ISP176X.BUS_DMA_REQ
BUS_ISP176X_NCS: U8.AB14(IO,_DIFFIO_B24n) ; port ISP176X.BUS_NCS
BUS_ISP176X_NIRQ: U8.AF16(IO,_DIFFIO_B32p,_(DQ4B)/(DQ5B)/(DQ5B)) ; port ISP176X.BUS_NIRQ
BUS_NBE0: U8.W21(IO,_DIFFIO_R47p)
BUS_NBE1: U8.A25(IO,_DIFFIO_T49p,_(DQS0T/CQ1T,CDPCLK6)/(DQS0T/CQ1T,CDPCLK6)/(DQS0T/CQ1T,CDPCLK6))
BUS_NBE2: U8.AC27(IO,_DIFFIO_R46n,_(DQ3R)/(DQ3R)/(DQ1R))
BUS_NBE3: U8.V26(IO)
BUS_NOE: U8.AF12(IO,_DIFFIO_B19n) ; port MEM_COMMON.BUS_NOE, port ISP176X.BUS_NREAD
BUS_NWE: U8.G7(IO,_DIFFIO_L6n) ; port MEM_COMMON.BUS_NWE, port ISP176X.BUS_NWRITE
BUS_SDRAM_CKE: R274.2 R275.1 U8.Y23(IO,_DIFFIO_R50p) ; port MEM_COMMON.BUS_SDRAM_CKE
BUS_SDRAM_CLK: NT3#2.2(Net2) R272.2 R273.1 U8.AE5(IO,_PLL1_CLKOUTp) ; port MEM_COMMON.BUS_SDRAM_CLK
BUS_SDRAM_FEEDBACK: NT3#2.1(Net1) U8.J1(CLK1,_DIFFCLK_0n)
BUS_SDRAM_NCAS: U8.AC26(IO,_DIFFIO_R49p) ; port MEM_COMMON.BUS_SDRAM_NCAS
BUS_SDRAM_NCS: U8.AA21(IO,_DIFFIO_R56n) ; port MEM_COMMON.BUS_SDRAM_NCS
BUS_SDRAM_NRAS: U8.AC24(IO,_DIFFIO_R55p) ; port MEM_COMMON.BUS_SDRAM_NRAS
BUS_SRAM_NCS: U8.D13(IO,_DIFFIO_T26p,_(DQ5T)/(DQ3T)/(DQ5T)) ; port MEM_COMMON.BUS_SRAM_NCS
BUZZER: U8.AA7(IO,_DIFFIO_L40p) ; port BUZZER
CODECI2S_BCLK: U8.K13(IO,_DIFFIO_T22n) ; port CODEC.I2S_BCLK
CODECI2S_DIN: U8.AB8(IO) ; port CODEC.I2S_DIN
CODECI2S_DOUT: U8.AE6(IO,_DIFFIO_B2n,_(DM1B)/_/_) ; port CODEC.I2S_DOUT
CODECI2S_MCLK: U8.G14(IO,_VREFB8N0) ; port CODEC.I2S_MCLK
CODECI2S_WCLK: U8.AF14(IO,_DIFFIO_B27n) ; port CODEC.I2S_WCLK
CODECSPI_CLK: U8.D15(IO,_DIFFIO_T27p,_(PADD14),_(DQ5T)/(DQ3T)/(DQ5T)) ; port CODEC.SPI_CLK
CODECSPI_CS: U8.W4(IO,_DIFFIO_L36n) ; port CODEC.SPI_CS_N
CODECSPI_DIN: U8.Y4(IO,_DIFFIO_L42p,_(DQ3L)/(DQ3L)/(DQ1L)) ; port CODEC.SPI_DIN
CODECSPI_DOUT: U8.AG4(IO,_DIFFIO_B4p) ; port CODEC.SPI_DOUT
CONF_DONE: R22.2 ; sheet U_FPGA_Power/CONF_DONE
DAC_CLK: U8.C14(IO,_DIFFIO_T25n,_(DQ5T)/(DQ3T)/(DQ5T)) ; port DAC.CLK
DAC_CS: U8.F3(IO,_DIFFIO_L7n,_(DQ2L)/(DQ1L)/(DQ1L)) ; port DAC.CS
DAC_DIN: U8.K3(IO,_DIFFIO_L13n) ; port DAC.DIN
DAU_FPGA_CLK1: U8.AG15(CLK13,_DIFFCLK_7p) U8.B15(CLK9,_DIFFCLK_5p) U8.J2(CLK0,_DIFFCLK_0p) ; port DB_CLOCKS.FPGA_CLK1
DAU_RESET_SW: U8.AG12(IO,_DIFFIO_B26p,_(DQ5B)/(DQ3B)/(DQ5B)) ; port DAU_RESET_SW
DAU_SPI_CLK: U8.AE14(IO,_DIFFIO_B27p) ; port DB_SPI.CLK
DAU_SPI_DIN: U8.AG23(IO,_DIFFIO_B50p) ; port DB_SPI.DOUT
DAU_SPI_DOUT: U8.AB27(IO,_DIFFIO_R44p,_(DQ1R)/(DQ3R)/(DQ1R)) ; port DB_SPI.DIN
DAU_SPI_MODE: U8.AF27(IO,_(DQS3R/CQ3R#,CDPCLK4)/(DQS3R/CQ3R#,CDPCLK4)/(DQS3R/CQ3R#,CDPCLK4)) ; port DB_SPI.MODE
DAU_SPI_SEL: U8.AE25(IO,_DIFFIO_B47n,_(DQ0B)/_/_) ; port DB_SPI.SEL
DB_REF_CLK: U70.1(REF) ; port DB_CLOCKS.REF_CLK
DCLK: R20.2 ; sheet U_FPGA_Power/DCLK
DIP0: U8.AF11(IO,_DIFFIO_B21n,_(DQS5B/CQ5B#,DPCLK3)/(DQS5B/CQ5B#,DPCLK3)/(DQS5B/CQ5B#,DPCLK3))
DIP1: U8.AC11(IO,_DIFFIO_B1p)
DIP2: U8.AE10(IO,_DIFFIO_B16p,_(DQS3B/CQ3B#,DPCLK2)/(DQS3B/CQ3B#,DPCLK2)/(DQS3B/CQ3B#,DPCLK2))
DIP3: U8.AF10(IO,_DIFFIO_B21p,_(DQ5B)/(DQ3B)/(DQ5B))
DIP4: U8.AG8(IO,_DIFFIO_B15p,_(DQ3B)/(DQ3B)/(DQ5B))
DIP5: U8.AE8(IO,_DIFFIO_B5n)
DIP6: U8.AC8(IO,_DIFFIO_B14p,_(DQ3B)/(DQ3B)/(DQ5B))
DIP7: U8.AC7(IO,_DIFFIO_L48n)
E_COL: U8.J3(IO,_DIFFIO_L19n,_(DQ0L)/(DQ1L)/(DQ1L)) ; port ETH.E_COL
E_CRS: U8.A6(IO,_DIFFIO_T8n) ; port ETH.E_CRS
E_MDC: U8.C2(IO,_DIFFIO_L1n,_(DQ2L)/(DQ1L)/(DQ1L)) ; port ETH.E_MDC
E_MDIO: U8.G6(IO,_DIFFIO_L4p,_(nRESET),_(DQ2L)/(DQ1L)/(DQ1L)) ; port ETH.E_MDIO
E_RESETB_E: U8.F5(IO,_DIFFIO_L8p,_(DQ2L)/(DQ1L)/(DQ1L)) ; port ETH.E_RESETB_E
E_RXC: U8.G15(IO,_VREFB7N3) ; port ETH.E_RXC
E_RXD0: U8.D2(IO,_DIFFIO_L2p,_(DQ2L)/(DQ1L)/(DQ1L))
E_RXD1: U8.D1(IO,_DIFFIO_L2n,_(DQ2L)/(DQ1L)/(DQ1L))
E_RXD2: U8.E3(IO,_DIFFIO_L7p,_(DQS2L/CQ3L,CDPCLK0)/(DQS2L/CQ3L,CDPCLK0)/(DQS2L/CQ3L,CDPCLK0))
E_RXD3: U8.H5(IO,_DIFFIO_L18n)
E_RXDV: U8.E4(IO,_DIFFIO_L3n) ; port ETH.E_RXDV
E_RXER: U8.B8(IO,_DIFFIO_T17n) ; port ETH.E_RXER
E_TXC: U8.J5(IO,_DIFFIO_L6p) ; port ETH.E_TXC
E_TXD0: U8.G4(IO,_DIFFIO_L9p,_(DQ2L)/(DQ1L)/(DQ1L))
E_TXD1: U8.F1(IO,_DIFFIO_L12n,_(DQ0L)/(DQ1L)/(DQ1L))
E_TXD2: U8.H6(IO,_DIFFIO_L18p)
E_TXD3: U8.G5(IO,_DIFFIO_L4n,_(DQ2L)/(DQ1L)/(DQ1L))
E_TXEN: U8.G3(IO,_DIFFIO_L9n) ; port ETH.E_TXEN
EXTEND_A0: U8.AA13(IO,_DIFFIO_B11n)
EXTEND_A1: U8.AH10(IO,_DIFFIO_B17n)
EXTEND_A2: U8.AF9(IO,_DIFFIO_B18p,_(DQ3B)/(DQ3B)/(DQ5B))
EXTEND_A3: U8.AG10(IO,_DIFFIO_B22p,_(DQ5B)/(DQ3B)/(DQ5B))
EXTEND_A4: U8.AH8(IO,_DIFFIO_B16n,_(DQ3B)/(DQ3B)/(DQ5B))
EXTEND_A5: U8.AH7(IO,_(DQ3B)/(DQ3B)/(DQ5B))
EXTEND_A6: U8.AG7(IO,_DIFFIO_B13p,_(DQ3B)/(DQ3B)/(DQ5B))
EXTEND_A7: U8.AF8(IO,_DIFFIO_B19p,_(DM5B/BWS#5B)/(DM3B0/BWS#3B0)/(DM5B2/BWS#5B2))
EXTEND_A8: U8.AB12(IO,_DIFFIO_B3n)
EXTEND_A9: U8.AF7(IO,_DIFFIO_B17p,_(DQ3B)/(DQ3B)/(DQ5B))
EXTEND_A10: U8.AF2(IO,_DIFFIO_L50n,_(DM3L/BWS#3L)/(DM3L1/BWS#3L1)/(DM1L3/BWS#1L3))
EXTEND_A11: U8.AF6(IO,_(DQ1B)/_/_)
EXTEND_A12: U8.AG6(IO,_DIFFIO_B10p,_(DQ1B)/_/_)
EXTEND_A13: U8.AH4(IO,_DIFFIO_B8n,_(DQ1B)/_/_)
EXTEND_A14: U8.AE1(IO,_DIFFIO_L49p)
EXTEND_A15: U8.AD7(IO,_DIFFIO_B6p,_(DQS1B/CQ1B#,CDPCLK2)/(DQS1B/CQ1B#,CDPCLK2)/(DQS1B/CQ1B#,CDPCLK2))
EXTEND_A16: U8.AB5(IO,_DIFFIO_L51n)
EXTEND_A17: U8.AF5(IO,_PLL1_CLKOUTn)
EXTEND_A18: U8.AH3(IO,_DIFFIO_B7p,_(DQ1B)/_/_)
EXTEND_A19: U8.AG3(IO,_DIFFIO_B4n,_(DQ1B)/_/_)
EXTEND_A20: U8.AF3(IO,_DIFFIO_L54n)
EXTEND_A21: U8.AE4(IO,_DIFFIO_L54p)
EXTEND_A22: U8.AC2(IO,_DIFFIO_L43n,_(DQ3L)/(DQ3L)/(DQ1L))
EXTEND_A23: U8.AE3(IO,_(DQS3L/CQ3L#,CDPCLK1)/(DQS3L/CQ3L#,CDPCLK1)/(DQS3L/CQ3L#,CDPCLK1))
EXTEND_A24: U8.AE2(IO,_DIFFIO_L49n,_(DQ3L)/(DQ3L)/(DQ1L))
EXTEND_A25: U8.Y7(IO,_DIFFIO_L41n)
EXTEND_A26: U8.AD1(IO,_DIFFIO_L46n)
EXTEND_A27: U8.AC1(IO,_DIFFIO_L44n,_(DQ3L)/(DQ3L)/(DQ1L))
EXTEND_A28: U8.AB3(IO,_DIFFIO_L47p,_(DQ3L)/(DQ3L)/(DQ1L))
EXTEND_A29: U8.AB2(IO,_DIFFIO_L34p,_(DQS1L/CQ1L#,DPCLK1)/(DQS1L/CQ1L#,DPCLK1)/(DQS1L/CQ1L#,DPCLK1))
EXTEND_A30: U8.AC3(IO,_DIFFIO_L45n,_(DQ3L)/(DQ3L)/(DQ1L))
EXTEND_A31: U8.AD3(IO,_DIFFIO_L52n)
EXTEND_A32: U8.W8(IO,_DIFFIO_L44p)
EXTEND_A33: U8.V8(IO,_VREFB2N2)
EXTEND_A34: U8.W10(IO,_DIFFIO_B7n)
EXTEND_A35: U8.Y3(IO,_DIFFIO_L42n)
EXTEND_A36: U8.W3(IO,_DIFFIO_L36p)
EXTEND_A37: U8.V3(IO,_DIFFIO_L33p)
EXTEND_A38: U8.AD5(IO,_DIFFIO_L53n)
EXTEND_A39: U8.AB4(IO,_VREFB2N3)
EXTEND_A40: U8.AA6(IO,_DIFFIO_L40n)
EXTEND_A41: U8.AB7(IO,_DIFFIO_L48p)
EXTEND_A42: U8.W2(IO,_DIFFIO_L35p,_(DQ1L)/(DQ3L)/(DQ1L))
EXTEND_A43: U8.U8(IO,_RDN1)
EXTEND_A44: U8.V2(IO,_DIFFIO_L33n,_(DQ1L)/(DQ3L)/(DQ1L))
EXTEND_A45: U8.AA5(IO,_DIFFIO_L50p)
EXTEND_A46: U8.U7(IO,_RUP1)
EXTEND_A47: U8.T8(IO,_VREFB2N0)
EXTEND_A48: U8.U3(IO,_DIFFIO_L27p,_(DM0L)/(DM1L1/BWS#1L1)/(DM1L1/BWS#1L1))
EXTEND_A49: U8.V6(IO,_DIFFIO_L37p)
FPGA_CCLK: R20.1 ; port DB_PROGRAM.CCLK
FPGA_CLK: U8.A14(CLK10,_DIFFCLK_4n) U8.A15(CLK8,_DIFFCLK_5n) U8.J27(CLK4,_DIFFCLK_2p) ; port DB_CLOCKS.FPGA_CLK
FPGA_DIN: R14.2 ; port DB_PROGRAM.DIN
FPGA_DONE: R4#1.1 R22.1 ; port STATUS_LED, port DB_PROGRAM.DONE
FPGA_ID0: NT2#2.1(Net1)
FPGA_ID1: NT3#3.1(Net1)
FPGA_ID2: NT4.1(Net1)
FPGA_ID3: NT5.1(Net1)
FPGA_INIT: R3#1.1 R18.2 ; port DB_PROGRAM.INIT
FPGA_M0: R23.1
FPGA_PROG_CLK: port DB_PROGRAM.PROG_CLK
FPGA_PROG_PWR_ON: port DB_PROGRAM.PROG_PWR_ON
FPGA_PROGRAM: R1#1.1 R24.1 ; port DB_PROGRAM.PROGRAM
FPGA_TCK: R9#1.1 ; harness JTAG.TCK
FPGA_TDI: R12.1 ; harness JTAG.TDI
FPGA_TDO: R2#1.1 R10.1 ; harness JTAG.TDO
FPGA_TMS: R8#1.1 ; harness JTAG.TMS
HOST_SPARE1: R23.2 U8.AC22(IO,_DIFFIO_B53n)
IO0: U8.N4(IO,_DIFFIO_L22p)
IO1: U8.R6(IO,_DIFFIO_L28n)
IO2: U8.M8(IO,_DIFFIO_L16p)
IO3: U8.R4(IO,_DIFFIO_L29p,_(DQ1L)/(DQ3L)/(DQ1L))
IO4: U8.M4(IO)
IO5: U8.N3(IO,_DIFFIO_L22n)
IO6: U8.L7(IO,_DIFFIO_L15n)
IO7: U8.R5(IO,_DIFFIO_L31n,_(DQ1L)/(DQ3L)/(DQ1L))
IO8: U8.M5(IO,_VREFB1N3)
IO9: U8.T9(IO,_DIFFIO_L43p)
IO10: U8.L8(IO,_DIFFIO_L15p)
IO11: U8.M7(IO,_DIFFIO_L16n)
IO12: U8.L1(IO,_DIFFIO_L23n,_(DQ0L)/(DQ1L)/(DQ1L))
IO13: U8.M1(IO,_DIFFIO_L24n,_(DQ0L)/(DQ1L)/(DQ1L))
IO14: U8.L4(IO,_DIFFIO_L17p)
IO15: U8.M9(IO)
IO16: U8.L5(IO,_VREFB1N1)
IO17: U8.M2(IO,_DIFFIO_L24p)
IO18: U8.J4(IO,_DIFFIO_L19p)
IO19: U8.L2(IO,_DIFFIO_L23p)
IO20: U8.J7(IO,_DIFFIO_L11n)
IO21: U8.K7(IO,_DIFFIO_L14p)
IO22: U8.J6(IO,_DIFFIO_L10n)
IO23: U8.L6(IO,_DIFFIO_L14n)
IO24: U8.H4(IO,_DIFFIO_L5p)
IO25: U8.K4(IO,_DIFFIO_L13p)
IO26: U8.R7(IO,_DIFFIO_L29n)
IO27: U8.K2(IO,_(DQS0L/CQ1L,DPCLK0)/(DQS0L/CQ1L,DPCLK0)/(DQS0L/CQ1L,DPCLK0))
IO28: U8.U6(IO,_DIFFIO_L39n,_(DQ3L)/(DQ3L)/(DQ1L))
IO29: U8.P1(IO,_DIFFIO_L25n,_(DQ0L)/(DQ1L)/(DQ1L))
IO30: U8.U4(IO,_DIFFIO_L31p)
IO31: U8.R1(IO,_DIFFIO_L26n,__/(DQ1L)/(DQ1L))
IO32: U8.V9(IO)
IO33: U8.U5(IO,_DIFFIO_L37n)
IO34: U8.V5(IO,_DIFFIO_L39p)
IO35: U8.AA8(IO,_DIFFIO_L41p)
IR38KRX: U8.AA15(IO,_VREFB4N3) ; port TFT_IO.IR38KRX
IR38KTX: U8.AB15(IO,_DIFFIO_B28p) ; port TFT_IO.IR38KTX
ISP176X_RST: U8.AH11(IO,_DIFFIO_B24p,_(DQ5B)/(DQ3B)/(DQ5B)) ; port ISP176X.ISP176X_NRESET
KBCLOCK: U8.AE7(IO,_DIFFIO_B5p) ; port KEYBOARD.CLOCK
KBDATA: U8.AD8(IO,_DIFFIO_B9n,_(DQ1B)/_/_) ; port KEYBOARD.DATA
LED0_B: U8.R3(IO,_DIFFIO_L28p,_(DQ1L)/(DQ3L)/(DQ1L)) ; sheet PULLDOWN/INT.BLUE
LED0_G: U8.U1(IO,_DIFFIO_L32p,_(DQ1L)/(DQ3L)/(DQ1L)) ; sheet PULLDOWN/INT.GREEN
LED0_R: U8.R2(IO,_DIFFIO_L26p,_(DQ0L)/(DQ1L)/(DQ1L)) ; sheet PULLDOWN/INT.RED
LED1_B: U8.V4(IO,_DIFFIO_L32n,_(DQ1L)/(DQ3L)/(DQ1L)) ; sheet PULLDOWN/INT.BLUE
LED1_G: U8.T3(IO,_DIFFIO_L30n) ; sheet PULLDOWN/INT.GREEN
LED1_R: U8.W9(IO) ; sheet PULLDOWN/INT.RED
LED2_B: U8.AD10(IO,_DIFFIO_B12n,_(DQ3B)/(DQ3B)/(DQ5B)) ; sheet PULLDOWN/INT.BLUE
LED2_G: U8.AG11(IO,_DIFFIO_B23n,_(DQ5B)/(DQ3B)/(DQ5B)) ; sheet PULLDOWN/INT.GREEN
LED2_R: U8.AC10(IO,_DIFFIO_B9p) ; sheet PULLDOWN/INT.RED
LED3_B: U8.AD11(IO,_DIFFIO_B1n) ; sheet PULLDOWN/INT.BLUE
LED3_G: U8.AC12(IO,_DIFFIO_B8p) ; sheet PULLDOWN/INT.GREEN
LED3_R: U8.Y13(IO,_DIFFIO_B13n) ; sheet PULLDOWN/INT.RED
LED4_B: U8.AB23(IO,_RDN3) ; sheet PULLDOWN/INT.BLUE
LED4_G: U8.AD26(IO,_DIFFIO_R52p,_(DQ3R)/(DQ3R)/(DQ1R)) ; sheet PULLDOWN/INT.GREEN
LED4_R: U8.AB24(IO,_DIFFIO_R55n,_(DM3R/BWS#3R)/(DM3R1/BWS#3R1)/(DM1R3/BWS#1R3)) ; sheet PULLDOWN/INT.RED
LED5_B: U8.AB20(IO,_VREFB4N0) ; sheet PULLDOWN/INT.BLUE
LED5_G: U8.AA24(IO,_VREFB5N3) ; sheet PULLDOWN/INT.GREEN
LED5_R: U8.AB25(IO,_DIFFIO_R40n) ; sheet PULLDOWN/INT.RED
LED6_B: U8.AA25(IO,_DIFFIO_R39n) ; sheet PULLDOWN/INT.BLUE
LED6_G: U8.AA23(IO,_DIFFIO_R51p) ; sheet PULLDOWN/INT.GREEN
LED6_R: U8.W26(IO,_DIFFIO_R42p,_(DQ1R)/(DQ3R)/(DQ1R)) ; sheet PULLDOWN/INT.RED
LED7_B: U8.AD27(IO,_DIFFIO_R49n,_(DQ3R)/(DQ3R)/(DQ1R)) ; sheet PULLDOWN/INT.BLUE
LED7_G: U8.AC28(IO,_DIFFIO_R47n,_(DQ3R)/(DQ3R)/(DQ1R)) ; sheet PULLDOWN/INT.GREEN
LED7_R: U8.Y22(IO,_DIFFIO_R53n) ; sheet PULLDOWN/INT.RED
MIDI_RX: U8.C4(IO,_DIFFIO_T1p,_(DQ1T)/_/_) ; port MIDI.MIDI_RX
MIDI_TX: U8.D6(IO,_(DQ1T)/_/_) ; port MIDI.MIDI_TX
MOUSECLOCK: U8.AE9(IO,_DIFFIO_B20p,_(DQ5B)/(DQ3B)/(DQ5B)) ; port MOUSE.CLOCK
MOUSEDATA: U8.Y10(IO,_VREFB3N3) ; port MOUSE.DATA
NC1: U8.Y2(CLK2,_DIFFCLK_1p)
NC2: U8.Y1(CLK3,_DIFFCLK_1n)
NC3: U8.Y28(CLK7,_DIFFCLK_3n)
NC4: U8.AH15(CLK12,_DIFFCLK_7n)
NC5: U8.AG14(CLK15,_DIFFCLK_6p)
NC6: U8.F4(IO,_DIFFIO_L8n,_(DATA1,_ASDO))
NC7: U8.E2(IO,_DIFFIO_L10p,_(FLASH_nCE,_nCSO))
nCONFIG: R24.2 ; sheet U_FPGA_Power/nCONFIG
NEXUS_TCK: U8.Y27(CLK6,_DIFFCLK_3p) ; harness JTAG.TCK
NEXUS_TDI: U8.AD21(IO) ; harness JTAG.TDI
NEXUS_TDO: U8.AC21(IO,_DIFFIO_B48p) ; harness JTAG.TDO
NEXUS_TMS: U8.AE22(IO,_DIFFIO_B52n) ; harness JTAG.TMS
nSTATUS: R18.1 ; sheet U_FPGA_Power/nSTATUS
ONE_WIRE_DB_PB: R283.2 U8.U2(IO,_DIFFIO_L27n) ; port ONE_WIRE_DB_PB
P0_PWM: U8.F8(IO,_DIFFIO_T9n) ; port PWM.PWM0
P1_PWM: U8.B7(IO,_DIFFIO_T11p,_(DATA5),_(DQ3T)/(DQ3T)/(DQ5T)) ; port PWM.PWM1
P2_PWM: U8.C6(IO,_DIFFIO_T2p,_(DQ1T)/_/_) ; port PWM.PWM2
P3_PWM: U8.B4(IO,_DIFFIO_T3p,_(DATA12),_(DQS1T/CQ1T#,CDPCLK7)/(DQS1T/CQ1T#,CDPCLK7)/(DQS1T/CQ1T#,CDPCLK7)) ; port PWM.PWM3
REF_CLKa: R314.1 U8.AH14(CLK14,_DIFFCLK_6n) U8.J28(CLK5,_DIFFCLK_2n)
REF_CLKb: R213.1 U8.B14(CLK11,_DIFFCLK_4p)
RELAY0: U8.C7(IO,_DIFFIO_T4n,_(DATA10),_(DQ1T)/_/_)
RELAY1: U8.C11(IO,_DIFFIO_T7n,_(DATA7),_(DQ3T)/(DQ3T)/(DQ5T))
RELAY2: U8.B12(IO,_DIFFIO_T23p)
RELAY3: U8.A12(IO,_DIFFIO_T23n,_(DQ5T)/(DQ3T)/(DQ5T))
RS232_CTS: U8.K1(IO,_DIFFIO_L21n,_(DQ0L)/(DQ1L)/(DQ1L)) ; port RS232.CTS
RS232_RTS: U8.F2(IO,_DIFFIO_L12p,_(DM2L)/(DM1L0/BWS#1L0)/(DM1L0/BWS#1L0)) ; port RS232.RTS
RS232_RX: U8.H3(IO,_DIFFIO_L5n) ; port RS232.RXD
RS232_TX: U8.D3(IO,_DIFFIO_L1p) ; port RS232.TXD
SCL: R277.2 U8.AD2(IO,_DIFFIO_L46p,_(DQ3L)/(DQ3L)/(DQ1L)) ; port I2C.SCL
SDA: R278.1 U8.V7(IO,_DIFFIO_L45p) ; port I2C.SDA
SDCLK: U8.AE13(IO,_DIFFIO_B25p,_(DQ5B)/(DQ3B)/(DQ5B)) ; port DBSD.CLK
SDCMD: U8.Y14(IO) ; port DBSD.CMD
SDDAT0: U8.AD24(IO,_DIFFIO_R53p)
SDDAT1: U8.AF25(IO,_DIFFIO_B42p,_(DM0B)/(DQ5B)/(DQ5B))
SDDAT2: U8.W16(IO,_DIFFIO_B31n)
SDDAT3: U8.Y12(IO,_DIFFIO_B6n)
SDDETECT: U8.AD14(IO,_DIFFIO_B26n) ; port DBSD.DETECT
SDPROTECT: U8.AC14(IO,_DIFFIO_B25n) ; port DBSD.PROTECT
SPAREIO1: U8.AA10(IO,_DIFFIO_B14n,_(DQ3B)/(DQ3B)/(DQ5B)) ; port SPAREIO.1
SPAREIO2: U8.AA12(IO,_VREFB3N2) ; port SPAREIO.2
SPAREIO3: U8.AB11(IO,_VREFB3N1) ; port SPAREIO.3
SPAREIO4: U8.AB13(IO,_DIFFIO_B10n) ; port SPAREIO.4
SPDIF_IN: U8.AF4(IO,_DIFFIO_B3p,_(DQ1B)/_/_) ; port SPDIF.IN
SPDIF_OUT: U8.AH6(IO,_DIFFIO_B11p,_(DQ1B)/_/_) ; port SPDIF.OUT
SRAM1_A0: U8.G13(IO,_DIFFIO_T18n,_(PADD19))
SRAM1_A1: U8.F15(IO,_DIFFIO_T32p)
SRAM1_A2: U8.D17(IO,_DIFFIO_T37p,_(PADD4),_(DQS2T/CQ3T,DPCLK8)/(DQS2T/CQ3T,DPCLK8)/(DQS2T/CQ3T,DPCLK8))
SRAM1_A3: U8.G19(IO,_DIFFIO_T49n)
SRAM1_A4: U8.A21(IO,_DIFFIO_T43p,_(DQ2T)/(DQ5T)/(DQ5T))
SRAM1_A5: U8.K25(IO,_DIFFIO_R28n)
SRAM1_A6: U8.L25(IO,_DIFFIO_R26p)
SRAM1_A7: U8.H7(IO,_VREFB1N0)
SRAM1_A8: U8.M26(IO,_DIFFIO_R21p,_(DQ0R)/(DQ1R)/(DQ1R))
SRAM1_A9: U8.V1(IO,_(DQ1L)/(DQ3L)/(DQ1L))
SRAM1_A10: U8.R22(IO,_DIFFIO_R38p)
SRAM1_A11: U8.L20(IO,_DIFFIO_R21n)
SRAM1_A12: U8.H22(IO,_DIFFIO_R11n)
SRAM1_A13: U8.J25(IO,_DIFFIO_R13p,__/(DQ1R)/(DQ1R))
SRAM1_A14: U8.J22(IO,_VREFB6N0)
SRAM1_A15: U8.C16(IO,_DIFFIO_T31n,_(PADD9),_(DQ4T)/(DQ5T)/(DQ5T))
SRAM1_A16: U8.H14(IO,_DIFFIO_T30n)
SRAM1_A17: U8.E12(IO,_DIFFIO_T16n,_(DATA14),_(DQS3T/CQ3T#,DPCLK11)/(DQS3T/CQ3T#,DPCLK11)/(DQS3T/CQ3T#,DPCLK11))
SRAM1_A18: U8.G27(IO,_DIFFIO_R12p,_(nOE),_(DQ2R)/(DQ1R)/(DQ1R))
SRAM1_D0: U8.D20(IO,_DIFFIO_T39n,_(DQ4T)/(DQ5T)/(DQ5T))
SRAM1_D1: U8.E22(IO,_DIFFIO_T51n,_(DQ0T)/_/_)
SRAM1_D2: U8.C23(IO,_PLL2_CLKOUTn)
SRAM1_D3: U8.F17(IO,_DIFFIO_T37n)
SRAM1_D4: U8.C26(IO,_DIFFIO_R1p)
SRAM1_D5: U8.G22(IO,_DIFFIO_R7p)
SRAM1_D6: U8.G24(IO,_DIFFIO_R25p)
SRAM1_D7: U8.H23(IO,_DIFFIO_R13n)
SRAM1_D8: U8.G25(IO,_DIFFIO_R10n)
SRAM1_D9: U8.E28(IO,_DIFFIO_R7n,_(PADD23),_(DQ2R)/(DQ1R)/(DQ1R))
SRAM1_D10: U8.D26(IO,_DIFFIO_R1n)
SRAM1_D11: U8.D28(IO,_DIFFIO_R5n,_(PADD22))
SRAM1_D12: U8.G10(IO,_DIFFIO_T12p)
SRAM1_D13: U8.B19(IO,_DIFFIO_T36p,_(PADD6),_(DQ4T)/(DQ5T)/(DQ5T))
SRAM1_D14: U8.D21(IO,_DIFFIO_T45n,_(DQ2T)/(DQ5T)/(DQ5T))
SRAM1_D15: U8.D19(IO,_DIFFIO_T44p)
SRAM1_NBHE: U8.G16(IO,_DIFFIO_T32n) ; port SRAM1.NBHE
SRAM1_NBLE: U8.D18(IO,_DIFFIO_T41p,_(PADD2)) ; port SRAM1.NBLE
SRAM1_NCS: U8.G20(IO,_DIFFIO_T50p) ; port SRAM1.NCS
SRAM1_NOE: U8.E15(IO,_DIFFIO_T28n,_(DM4T)/(DM5T1/BWS#5T1)/(DM5T1/BWS#5T1)) ; port SRAM1.NOE
SRAM1_NWE: U8.K22(IO,_DIFFIO_R20n) ; port SRAM1.NWE
SRAM2_A0: U8.E17(IO,_DIFFIO_T34n,_(DQ4T)/(DQ5T)/(DQ5T))
SRAM2_A1: U8.F18(IO,_VREFB7N1)
SRAM2_A2: U8.B21(IO,_DIFFIO_T42n,_(DQ2T)/(DQ5T)/(DQ5T))
SRAM2_A3: U8.E19(IO,_RDN4)
SRAM2_A4: U8.F19(IO,_RUP4)
SRAM2_A5: U8.J23(IO,_DIFFIO_R18n)
SRAM2_A6: U8.M25(IO,_VREFB6N2)
SRAM2_A7: U8.R21(IO,_DIFFIO_R29p)
SRAM2_A8: U8.L27(IO,_DIFFIO_R17n,_(DQ0R)/(DQ1R)/(DQ1R))
SRAM2_A9: U8.U20(IO,_DIFFIO_R42n)
SRAM2_A10: U8.M28(IO,_DIFFIO_R22n,_(DQ0R)/(DQ1R)/(DQ1R))
SRAM2_A11: U8.N25(IO,_DIFFIO_R25n)
SRAM2_A12: U8.M24(IO,_DIFFIO_R28p)
SRAM2_A13: U8.N21(IO,_VREFB6N3)
SRAM2_A14: U8.L23(IO,_DIFFIO_R20p)
SRAM2_A15: U8.E18(IO,_DIFFIO_T42p,_(DQ2T)/(DQ5T)/(DQ5T))
SRAM2_A16: U8.H16(IO,_DIFFIO_T33p)
SRAM2_A17: U8.D16(IO,_DIFFIO_T31p,_(PADD10))
SRAM2_A18: U8.L22(IO,_DIFFIO_R23p)
SRAM2_D0: U8.J17(IO,_DIFFIO_T33n)
SRAM2_D1: U8.G21(IO)
SRAM2_D2: U8.C25(IO,_DIFFIO_T48p,_(DQ0T)/_/_)
SRAM2_D3: U8.H19(IO,_DIFFIO_T47n)
SRAM2_D4: U8.J19(IO,_DIFFIO_T51p)
SRAM2_D5: U8.E26(IO,_DIFFIO_R3n)
SRAM2_D6: U8.E27(IO,_DIFFIO_R6n,_(DQ2R)/(DQ1R)/(DQ1R))
SRAM2_D7: U8.E1(IO,_DIFFIO_L11p,__/(DQ1L)/(DQ1L))
SRAM2_D8: U8.F27(IO,_DIFFIO_R8p,_(RDY))
SRAM2_D9: U8.F26(IO,_(DQ2R)/(DQ1R)/(DQ1R))
SRAM2_D10: U8.D27(IO,_DIFFIO_R5p,_(PADD21),_(DQ2R)/(DQ1R)/(DQ1R))
SRAM2_D11: U8.E25(IO,_DIFFIO_R16n)
SRAM2_D12: U8.A19(IO,_DIFFIO_T36n,_(PADD5),_(DQ4T)/(DQ5T)/(DQ5T))
SRAM2_D13: U8.B25(IO,_(DQ0T)/_/_)
SRAM2_D14: U8.A26(IO,_DIFFIO_T50n,_(DQ0T)/_/_)
SRAM2_D15: U8.E21(IO,_DIFFIO_T46p)
SRAM2_NBHE: U8.C21(IO,_DIFFIO_T44n,_(DQ2T)/(DQ5T)/(DQ5T)) ; port SRAM2.NBHE
SRAM2_NBLE: U8.B23(IO,_DIFFIO_T47p,_(DM0T)/_/_) ; port SRAM2.NBLE
SRAM2_NCS: U8.J10(IO,_DIFFIO_T10p) ; port SRAM2.NCS
SRAM2_NOE: U8.C20(IO,_DIFFIO_T40n,_(DM2T)/(DM5T0/BWS#5T0)/(DM5T0/BWS#5T0)) ; port SRAM2.NOE
SRAM2_NWE: U8.M21(IO,_VREFB6N1) ; port SRAM2.NWE
SW0: U8.M3(IO,_DIFFIO_L21p)
SW1: U8.W1(IO,_DIFFIO_L35n,_(DM1L/BWS#1L)/(DM3L0/BWS#3L0)/(DM1L2/BWS#1L2))
SW2: U8.AB1(IO,_DIFFIO_L34n)
SW3: U8.AB6(IO,_DIFFIO_L51p)
SW4: U8.AA3(IO)
TCK: R9#1.2 ; sheet U_FPGA_Power/TCK
TDI: R12.2 ; sheet U_FPGA_Power/TDI
TDO: R10.2 ; sheet U_FPGA_Power/TDO
TFT_BLIGHT: U8.AF26(IO,_DIFFIO_B48n,_(DQS0B/CQ1B,CDPCLK3)/(DQS0B/CQ1B,CDPCLK3)/(DQS0B/CQ1B,CDPCLK3)) ; port TFT_IO.BL
TFT_CS: U8.AG18(IO,_DIFFIO_B34n,_(DQ4B)/(DQ5B)/(DQ5B)) ; port TFT_IO.CS
TFT_DB0: U8.AF15(IO,_DIFFIO_B30p,_(DQ4B)/(DQ5B)/(DQ5B))
TFT_DB1: U8.AD17(IO,_DIFFIO_B36p,_(DQ2B)/(DQ5B)/(DQ5B))
TFT_DB2: U8.AH12(IO,_DIFFIO_B18n)
TFT_DB3: U8.AG17(IO,_DIFFIO_B30n,_(DQ4B)/(DQ5B)/(DQ5B))
TFT_DB4: U8.AG26(IO,_DIFFIO_B51n,_(DQ0B)/_/_)
TFT_DB5: U8.AH18(IO,_DIFFIO_B35p,_(DQ4B)/(DQ5B)/(DQ5B))
TFT_DB6: U8.AH17(IO,_DIFFIO_B31p,_(DQ4B)/(DQ5B)/(DQ5B))
TFT_DB7: U8.AE12(IO,_DIFFIO_B22n,_(DQ5B)/(DQ3B)/(DQ5B))
TFT_DB10: U8.AE23(IO,_PLL4_CLKOUTp)
TFT_DB11: U8.AH26(IO)
TFT_DB12: U8.AE20(IO,_DIFFIO_B45n)
TFT_DB13: U8.AA17(IO,_RUP2)
TFT_DB14: U8.AF21(IO,_DIFFIO_B47p)
TFT_DB15: U8.AB18(IO,_DIFFIO_B44p)
TFT_DB16: U8.AF18(IO,_DIFFIO_B36n)
TFT_DB17: U8.AB17(IO,_RDN2)
TFT_RD: U8.AF22(IO,_DIFFIO_B50n,_(DQ0B)/_/_) ; port TFT_IO.RD
TFT_RESET: U8.Y17(IO,_VREFB4N2) ; port TFT_IO.RESET
TFT_RS: U8.AF20(IO,_DIFFIO_B42n,_(DQ0B)/_/_) ; port TFT_IO.RS
TFT_TSC_BUSY: U8.W28(IO,_DIFFIO_R41p,_(DQ1R)/(DQ3R)/(DQ1R)) ; port TFT_TSC.BUSY
TFT_TSC_CLK: U8.AB16(IO,_DIFFIO_B33p,_(DQ4B)/(DQ5B)/(DQ5B)) ; port TFT_TSC.CLK
TFT_TSC_CS_N: U8.AD28(IO,_DIFFIO_R50n,_(DQ3R)/(DQ3R)/(DQ1R)) ; port TFT_TSC.CS_N
TFT_TSC_DIN: U8.AD25(IO) ; port TFT_TSC.DIN
TFT_TSC_DOUT: U8.AA22(IO,_RUP3) ; port TFT_TSC.DOUT
TFT_TSC_IRQ_N: U8.AB19(IO,_DIFFIO_B46n) ; port TFT_TSC.TFT_INT
TFT_WR: U8.AF23(IO,_PLL4_CLKOUTn) ; port TFT_IO.WR
TMS: R8#1.2 ; sheet U_FPGA_Power/TMS
USB_D0: U8.AF19(IO,_DIFFIO_B41n)
USB_D1: U8.Y19(IO,_DIFFIO_B43p)
USB_D2: U8.AG19(IO,_DIFFIO_B39n)
USB_D3: U8.AA16(IO)
USB_D4: U8.AE28(IO,_DIFFIO_R51n,_(DQ3R)/(DQ3R)/(DQ1R))
USB_D5: U8.AH21(IO,_DIFFIO_B38p,_(DQ2B)/(DQ5B)/(DQ5B))
USB_D6: U8.AG21(IO,_DIFFIO_B37p,_(DQ2B)/(DQ5B)/(DQ5B))
USB_D7: U8.AH22(IO,_DIFFIO_B39p,_(DQ2B)/(DQ5B)/(DQ5B))
USB_FIFOADR0: U8.AC18(IO,_VREFB4N1) ; port DBUSB.FIFOADR0
USB_FIFOADR1: U8.AC25(IO,_DIFFIO_R52n) ; port DBUSB.FIFOADR1
USB_FIFOADR2: U8.AC19(IO,_DIFFIO_B46p) ; port DBUSB.FIFOADR2
USB_FLAGA: U8.AE18(IO,_(DQS2B/CQ3B,DPCLK5)/(DQS2B/CQ3B,DPCLK5)/(DQS2B/CQ3B,DPCLK5)) ; port DBUSB.FLAGA
USB_FLAGB: U8.AD18(IO,_(DQ0B)/_/_) ; port DBUSB.FLAGB
USB_FLAGC: U8.AD22(IO,_DIFFIO_B52p) ; port DBUSB.FLAGC
USB_FLAGD_CS_N: U8.AG22(IO,_DIFFIO_B38n,_(DQ2B)/(DQ5B)/(DQ5B)) ; port DBUSB.FLAGD_CS_N
USB_IFCLK: U8.AE15(IO,_DIFFIO_B29n,__/(DQ5B)/(DQ5B)) ; port DBUSB.IFCLK
USB_INT_N: U8.AF24(IO,_DIFFIO_B41p,_(DQ2B)/(DQ5B)/(DQ5B)) ; port DBUSB.INT_N
USB_PKTEND: U8.AH23(IO,_DIFFIO_B40p,_(DQ2B)/(DQ5B)/(DQ5B)) ; port DBUSB.PKTEND
USB_RD_N: U8.AB22(IO,_DIFFIO_R56p) ; port DBUSB.RD_N
USB_READY: U8.R27(IO,__/(DQ1R)/(DQ1R)) ; port DBUSB.READY
USB_RESET_N: U8.AG25(IO,_DIFFIO_B49p) ; port DBUSB.RESET_N
USB_SLOE: U8.AD19(IO,_DIFFIO_B45p) ; port DBUSB.SLOE
USB_VBUS: U8.AE19(IO,_DIFFIO_B40n,_(DQ2B)/(DQ5B)/(DQ5B)) ; port DBUSB.VBUS
USB_WR_N: U8.W20(IO,_DIFFIO_R34n) ; port DBUSB.WR_N
VGA_BLUE0: U8.H12(IO,_DIFFIO_T21n)
VGA_BLUE1: U8.F11(IO,_VREFB8N1)
VGA_BLUE2: U8.J12(IO,_DIFFIO_T21p)
VGA_BLUE3: U8.G12(IO,_VREFB8N2)
VGA_BLUE4: U8.B11(IO,_DIFFIO_T20p,_(DATA3),_(DQ5T)/(DQ3T)/(DQ5T))
VGA_BLUE5: U8.D10(IO,_DIFFIO_T15n,_(DQ3T)/(DQ3T)/(DQ5T))
VGA_BLUE6: U8.G11(IO,_DIFFIO_T11n)
VGA_BLUE7: U8.E10(IO,_DIFFIO_T13n)
VGA_CLK: U8.B6(IO,_DIFFIO_T8p,_(DATA6),_(DQ3T)/(DQ3T)/(DQ5T)) ; port VGA.VGA_CLK
VGA_GREEN0: U8.D9(IO,_DIFFIO_T6p,_(DATA8))
VGA_GREEN1: U8.A8(IO,_DIFFIO_T5n,_(DATA9),_(DM3T/BWS#3T)/(DM3T1/BWS#3T1)/(DM5T3/BWS#5T3))
VGA_GREEN2: U8.D8(IO,_(DQ1T)/_/_)
VGA_GREEN3: U8.C8(IO,_DIFFIO_T5p,_(DQ1T)/_/_)
VGA_GREEN4: U8.D7(IO,_DIFFIO_T4p,_(DATA11))
VGA_GREEN5: U8.E7(IO,_DIFFIO_T13p)
VGA_GREEN6: U8.F7(IO,_DIFFIO_T9p)
VGA_GREEN7: U8.E5(IO,_DIFFIO_L3p)
VGA_HSYNC: U8.C12(IO,_DIFFIO_T24n,_(PADD16),_(DQ5T)/(DQ3T)/(DQ5T)) ; port VGA.VGA_HSYNC
VGA_RED0: U8.A10(IO,_DIFFIO_T19n,_(PADD18))
VGA_RED1: U8.B10(IO,_DIFFIO_T19p,_(DATA4),_(DM5T/BWS#5T)/(DM3T0/BWS#3T0)/(DM5T2/BWS#5T2))
VGA_RED2: U8.F10(IO,_DIFFIO_T15p)
VGA_RED3: U8.H10(IO,_DIFFIO_T7p)
VGA_RED4: U8.C10(IO,_DIFFIO_T17p,_(DQ3T)/(DQ3T)/(DQ5T))
VGA_RED5: U8.G8(IO)
VGA_RED6: U8.G9(IO,_VREFB8N3)
VGA_RED7: U8.C9(IO,_DIFFIO_T6n,_(DQ3T)/(DQ3T)/(DQ5T))
VGA_VSYNC: U8.H13(IO,_DIFFIO_T18p,_(DATA15),_(DQ3T)/(DQ3T)/(DQ5T)) ; port VGA.VGA_VSYNC
NetR14_1: R14.1 U8.N7(IO,_(DATA0))
NetR213_2: R213.2 U70.7(CLK4)
NetR314_2: R314.2 U70.2(CLK2)

Not connected (* = marked no-connect by the designer): U8 A3(IO,_DIFFIO_T2n,_(DQ1T)/_/_)* A4(IO,_DIFFIO_T3n,_(DQ1T)/_/_)* A7(IO,_DIFFIO_T12n,_(DQ3T)/(DQ3T)/(DQ5T))* A11(IO,_DIFFIO_T20n,_(DATA2),_(DQ5T)/(DQ3T)/(DQ5T))* A18(IO,_DIFFIO_T35n,_(PADD7))* A22(IO,_DIFFIO_T43n,_(DQ2T)/(DQ5T)/(DQ5T))* A23(IO,_(DQ0T)/_/_)* AA4(IO,_DIFFIO_L47n,_(DQ3L)/(DQ3L)/(DQ1L))* AA14(IO,_VREFB3N0)* AA19(IO,_DIFFIO_B44n)* AB9(IO,_DIFFIO_B12p,_(DM3B/BWS#3B)/(DM3B1/BWS#3B1)/(DM5B3/BWS#5B3))* AB21(IO,_DIFFIO_B53p)* AC4(IO,_DIFFIO_L52p)* AC5(IO,_DIFFIO_L53p)* AC15(IO,_DIFFIO_B28n,_(DM4B)/(DM5B1/BWS#5B1)/(DM5B1/BWS#5B1))* AC17(IO,_DIFFIO_B37n)* AD4(IO)* AD15(IO,_DIFFIO_B29p)* AE11(IO,_DIFFIO_B23p,_(DQ5B)/(DQ3B)/(DQ5B))* AE16(IO,_DIFFIO_B33n)* AE17(IO,_DIFFIO_B34p,_(DQ4B)/(DQ5B)/(DQ5B))* AE21(IO,_DIFFIO_B43n,_(DQ0B)/_/_)* AE24(IO,_DIFFIO_B51p,_(DQ0B)/_/_)* B17(IO,_DIFFIO_T29p,_(PADD12),_(DQS4T/CQ5T,DPCLK9)/(DQS4T/CQ5T,DPCLK9)/(DQS4T/CQ5T,DPCLK9))* B22(IO,_DIFFIO_T45p,_(PADD0))* B26(IO,_DIFFIO_T52n,_(DQ0T)/_/_)* C5(IO,_PLL3_CLKOUTn)* C22(IO,_(DQ2T)/(DQ5T)/(DQ5T))* C24(IO,_DIFFIO_T46n,_(DQ2T)/(DQ5T)/(DQ5T))* D4(IO,_(DM1T)/_/_)* D5(IO,_PLL3_CLKOUTp)* D11(IO)* D12(IO,_DIFFIO_T24p,_(PADD17),_(DQS5T/CQ5T#,DPCLK10)/(DQS5T/CQ5T#,DPCLK10)/(DQS5T/CQ5T#,DPCLK10))* D14(IO,_DIFFIO_T25p,_(PADD15))* D22(IO,_DIFFIO_T52p,_(DQ0T)/_/_)* D23(IO,_PLL2_CLKOUTp)* D24(IO,_DIFFIO_R2p)* E11(IO,_DIFFIO_T14n,_(DQ3T)/(DQ3T)/(DQ5T))* E14(IO,_(DQ5T)/(DQ3T)/(DQ5T))* E24(IO,_DIFFIO_R3p)* F12(IO,_DIFFIO_T16p,_(DATA13))* F21(IO,_DIFFIO_T48n,_(DQ0T)/_/_)* F22(IO,_VREFB7N0)* F24(IO,_DIFFIO_R15n)* F25(IO,_DIFFIO_R4p)* G17(IO,_VREFB7N2)* G18(IO,_DIFFIO_T38p)* G23(IO,_DIFFIO_R9p)* G28(IO,_DIFFIO_R12n,_(nWE),_(DQ2R)/(DQ1R)/(DQ1R))* H15(IO)* H17(IO,_DIFFIO_T40p)* H21(IO,_DIFFIO_R6p)* H24(IO,_DIFFIO_R11p)* J14(IO,_DIFFIO_T28p)* J16(IO,_DIFFIO_T34p)* J24(IO,_DIFFIO_R14n)* K15(IO,_DIFFIO_T30p)* L24(IO,_DIFFIO_R17p,_(DQ0R)/(DQ1R)/(DQ1R))* N8(IO,_VREFB1N2)* T4(IO,_DIFFIO_L30p,_(DQ1L)/(DQ3L)/(DQ1L))* T7(IO,_VREFB2N1)* T25(IO,_DIFFIO_R33p,_(DQS1R/CQ1R#,DPCLK6)/(DQS1R/CQ1R#,DPCLK6)/(DQS1R/CQ1R#,DPCLK6))* U23(IO,_VREFB5N1)* U24(IO,_VREFB5N2)* V20(IO,_DIFFIO_R33n)* V23(IO,_DIFFIO_R36n)* W25(IO)* Y5(IO,_DIFFIO_L38p)* Y6(IO,_DIFFIO_L38n)* Y15(IO,_DIFFIO_B15n)* Y24(IO,_DIFFIO_R48n,_(DQ3R)/(DQ3R)/(DQ1R))* Y25(IO,_DIFFIO_R35n)*; U70 3(CLK1)* 5(CLK3)* 8(CLKOUT)*

### Buses and harness runs
bus BUS_A[17..1]
bus BUS_A[24..1]
bus BUS_D[31..0]
bus BUS_NBE[3..0]
bus DIP[7..0]
bus E_RXD[3..0]
bus E_TXD[3..0]
bus EXTEND_A[49..0]
bus FPGA_ID[3..0]
bus FPGA_M[2..0]
bus IO[35..0]
bus RELAY[3..0]
bus SDDAT[3..0]
bus SRAM1_A[18..0]
bus SRAM1_D[15..0]
bus SRAM2_A[18..0]
bus SRAM2_D[15..0]
bus SW[4..0]
bus TFT_DB[17..0]
bus USB_D[15..0]
bus VGA_BLUE[7..0]
bus VGA_GREEN[7..0]
bus VGA_RED[7..0]

### Notes on the sheet
- USER/DB FPGA
- JTAG
- PROGRAM
- SPI
- CLOCKS
- COMMON MEMORY RESOURCES
- (near NT3#2) STANDALON MEMORY RESOURCES
- AVOID PIN
- PERIPHERALS
- USB2
- PLL1
- PLL2
- PLL3
- PLL4
- (near R4#1) 1V2
- 3V3
- (near NT2#2) FPGA_ID = 0x1 (Altera)
- Project Title
- Sheet Title
- Size:
- Date:
- File:
- A0
- Assy:
- Time:
- Sheet
- Revision:
- of
- (in symbol D-241-0023, part A) BANK 1
- (in symbol D-241-0023, part B) BANK 2
- (in symbol D-241-0023, part C) BANK 3
- (in symbol D-241-0023, part D) BANK 4
- (in symbol D-241-0023, part E) BANK 5
- (in symbol D-241-0023, part F) BANK 6
- (in symbol D-241-0023, part G) BANK 7
- (in symbol D-241-0023, part H) BANK 8

### Library data of the parts
NT2#2 NT3#2 NT3#3 NT4 NT5 = D-002-0002: Net-Tie, Surface Mount, 2 x 0.4mm x 0.2mm SMT Pads - For 0.2mm Track; Status: Production; Category: Net-Tie
R1#1 R2#1 R3#1 R4#1 R277 R278 R283 = D-100-0088: as R98 on sheet Audio_Codec; Mounting Technology: Surface Mount; Status: Production; Tolerance: 1 %; Category: Resistor
R8#1 R9#1 R10 R12 R14 R18 R20 R22-R24 = D-100-0131: Resistor, 100R 1% 0402 (1005); Power Rating: 63 mW; Mounting Technology: Surface Mount; Resistance: 100 R; Status: Production; Tolerance: 1 %; Category: Resistor
R213 R314 = D-100-0085: Resistor, 5R6 1% 0402 (1005); Power Rating: 63 mW; Resistance: 5.6 R; Category: Resistor; Status: Production; Mounting Technology: Surface Mount; Tolerance: 1 %
R272-R275 = D-100-0107: Resistor, 2K2 1% 0402 (1005); Power Rating: 63 mW; Resistance: 2.2 K; Category: Resistor; Mounting Technology: Surface Mount; Status: Production; Tolerance: 1 %
U8 = D-241-0023: FPGA, Altera Cyclone3-40 F780; Supply Voltage: mV; Mounting Technology: Surface Mount; Status: Unreleased; Technology: None; Category: IC-FPGA
U70 = D-200-0000: CY2305 Zero-Delay Buffer SOIC 8-pin 150mil body; Supply Voltage: 3.3 V; Mounting Technology: Surface Mount; Status: Unreleased; Temperature Range: 0 - 70 degC; Category: IC-Analog

## Sheet FPGA_Bypass_3V3.SCHDOC: FPGA Bypass 3V3
size A4; Organization: Altium Limited.; Address1: Level 3, 12a Rodborough Rd; Address2: Frenchs Forest 2086; Address3: NSW; Address4: AUSTRALIA; DocumentNumber: 58; SheetNumber: 59; SheetTotal: 78; PageSetup: Record=PageOptions|CenterHorizontal=True|CenterVertical=True|PrintScale=0.97|XCorrection=1.00|YCorrection=1.00|PrintKind=0|BorderSize=5000000|LeftOffset=0|BottomOffset=0|Orientation=2|PaperLength=1000|PaperWidth=1000|Scale=100|PaperSource=7|PrintQuality=-4|MediaType=1|DitherType=10|PaperKind=A4 (210 x 297 mm)|PrintScaleMode=1
Used 2 times, as channels USER_DECOUPLING_CAPS_3V3, HOST_DECOUPLING_CAPS_3V3. Parts and nets are listed once, with the designators drawn on the sheet.
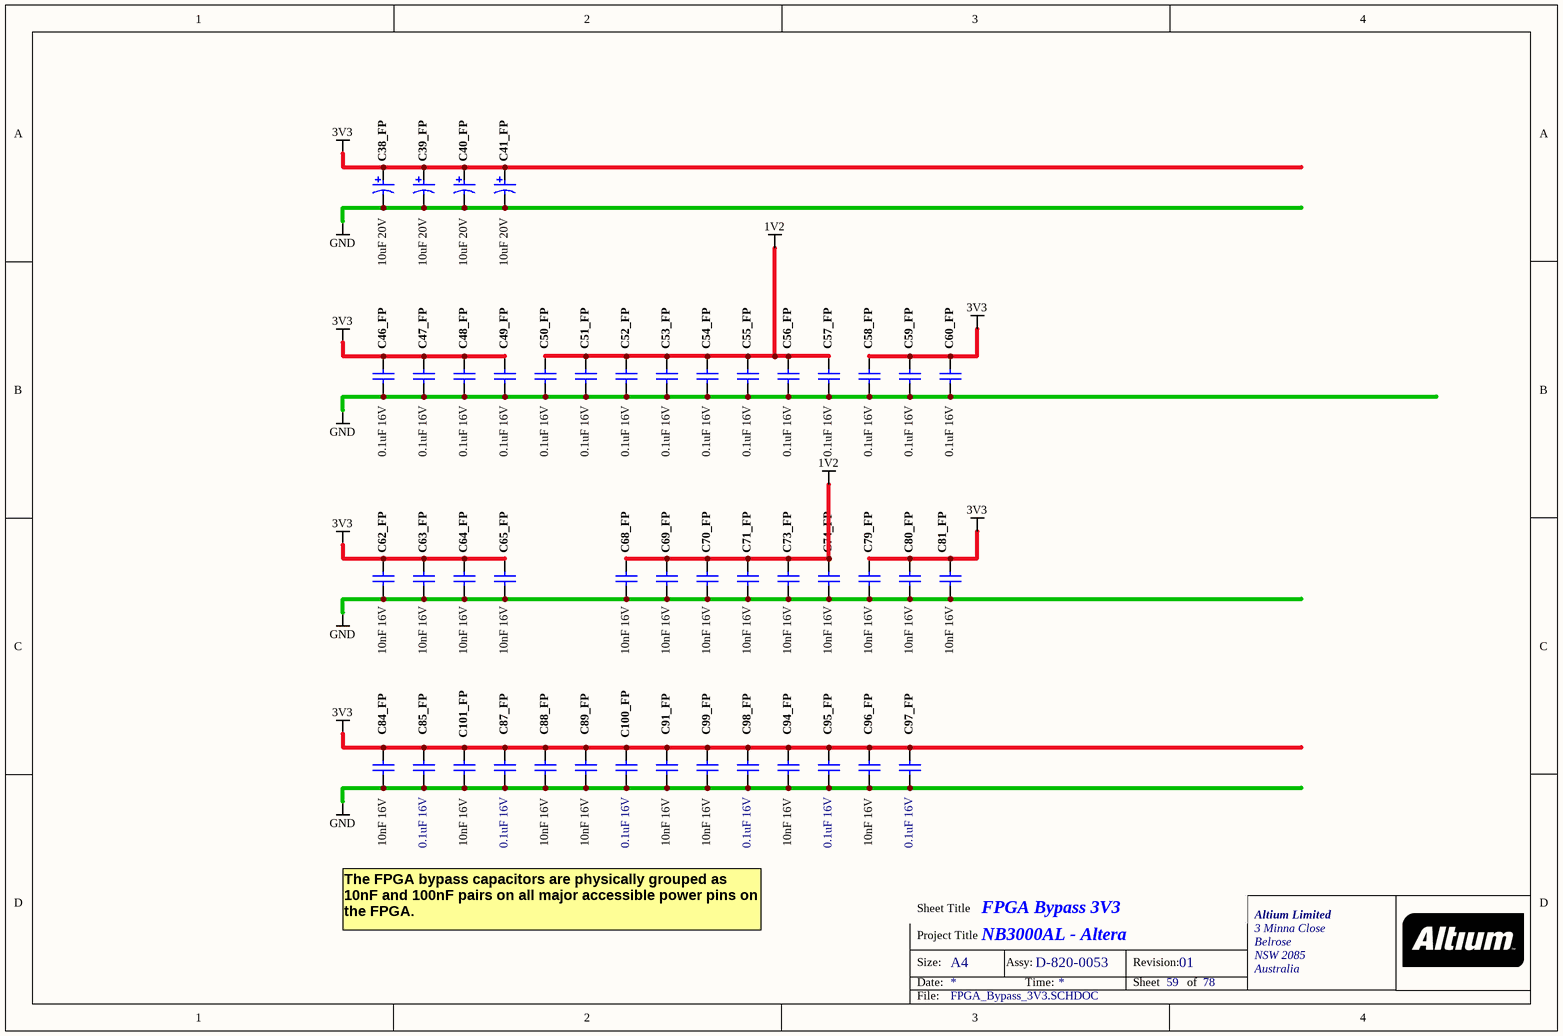
[diagram p9: FPGA_Bypass_3V3.SCHDOC]

### Parts
C38_FP  10uF 20V  [CAPC3528-STAR]
C39_FP  10uF 20V  [CAPC3528-STAR]
C40_FP  10uF 20V  [CAPC3528-STAR]
C41_FP  10uF 20V  [CAPC3528-STAR]
C46_FP  0.1uF 16V  [CAPC1005-STAR]
C47_FP  0.1uF 16V  [CAPC1005-STAR]
C48_FP  0.1uF 16V  [CAPC1005-STAR]
C49_FP  0.1uF 16V  [CAPC1005-STAR]
C50_FP  0.1uF 16V  [CAPC1005-STAR]
C51_FP  0.1uF 16V  [CAPC1005-STAR]
C52_FP  0.1uF 16V  [CAPC1005-STAR]
C53_FP  0.1uF 16V  [CAPC1005-STAR]
C54_FP  0.1uF 16V  [CAPC1005-STAR]
C55_FP  0.1uF 16V  [CAPC1005-STAR]
C56_FP  0.1uF 16V  [CAPC1005-STAR]
C57_FP  0.1uF 16V  [CAPC1005-STAR]
C58_FP  0.1uF 16V  [CAPC1005-STAR]
C59_FP  0.1uF 16V  [CAPC1005-STAR]
C60_FP  0.1uF 16V  [CAPC1005-STAR]
C62_FP  10nF 16V  [CAPC1005-STAR]
C63_FP  10nF 16V  [CAPC1005-STAR]
C64_FP  10nF 16V  [CAPC1005-STAR]
C65_FP  10nF 16V  [CAPC1005-STAR]
C68_FP  10nF 16V  [CAPC1005-STAR]
C69_FP  10nF 16V  [CAPC1005-STAR]
C70_FP  10nF 16V  [CAPC1005-STAR]
C71_FP  10nF 16V  [CAPC1005-STAR]
C73_FP  10nF 16V  [CAPC1005-STAR]
C74_FP  10nF 16V  [CAPC1005-STAR]
C79_FP  10nF 16V  [CAPC1005-STAR]
C80_FP  10nF 16V  [CAPC1005-STAR]
C81_FP  10nF 16V  [CAPC1005-STAR]
C84_FP  10nF 16V  [CAPC1005-STAR]
C85_FP  0.1uF 16V  [CAPC1005-STAR]
C87_FP  0.1uF 16V  [CAPC1005-STAR]
C88_FP  10nF 16V  [CAPC1005-STAR]
C89_FP  10nF 16V  [CAPC1005-STAR]
C91_FP  10nF 16V  [CAPC1005-STAR]
C94_FP  10nF 16V  [CAPC1005-STAR]
C95_FP  0.1uF 16V  [CAPC1005-STAR]
C96_FP  10nF 16V  [CAPC1005-STAR]
C97_FP  0.1uF 16V  [CAPC1005-STAR]
C98_FP  0.1uF 16V  [CAPC1005-STAR]
C99_FP  10nF 16V  [CAPC1005-STAR]
C100_FP  0.1uF 16V  [CAPC1005-STAR]
C101_FP  10nF 16V  [CAPC1005-STAR]

### Nets
1V2: C50_FP.1 C51_FP.1 C52_FP.1 C53_FP.1 C54_FP.1 C55_FP.1 C56_FP.1 C57_FP.1 C68_FP.1 C69_FP.1 C70_FP.1 C71_FP.1 C73_FP.1 C74_FP.1
3V3: C38_FP.1 C39_FP.1 C40_FP.1 C41_FP.1 C46_FP.1 C47_FP.1 C48_FP.1 C49_FP.1 C58_FP.1 C59_FP.1 C60_FP.1 C62_FP.1 C63_FP.1 C64_FP.1 C65_FP.1 C79_FP.1 C80_FP.1 C81_FP.1 C84_FP.1 C85_FP.1 C87_FP.1 C88_FP.1 C89_FP.1 C91_FP.1 C94_FP.1 C95_FP.1 C96_FP.1 C97_FP.1 C98_FP.1 C99_FP.1 C100_FP.1 C101_FP.1
GND: C38_FP.2 C39_FP.2 C40_FP.2 C41_FP.2 C46_FP.2 C47_FP.2 C48_FP.2 C49_FP.2 C50_FP.2 C51_FP.2 C52_FP.2 C53_FP.2 C54_FP.2 C55_FP.2 C56_FP.2 C57_FP.2 C58_FP.2 C59_FP.2 C60_FP.2 C62_FP.2 C63_FP.2 C64_FP.2 C65_FP.2 C68_FP.2 C69_FP.2 C70_FP.2 C71_FP.2 C73_FP.2 C74_FP.2 C79_FP.2 C80_FP.2 C81_FP.2 C84_FP.2 C85_FP.2 C87_FP.2 C88_FP.2 C89_FP.2 C91_FP.2 C94_FP.2 C95_FP.2 C96_FP.2 C97_FP.2 C98_FP.2 C99_FP.2 C100_FP.2 C101_FP.2

### Channels
USER_DECOUPLING_CAPS_3V3: designators end in A
HOST_DECOUPLING_CAPS_3V3: designators end in B

### Notes on the sheet
- The FPGA bypass capacitors are physically grouped as 10nF and 100nF pairs on all major accessible power pins on the FPGA.
- Sheet Title
- Project Title
- Size:
- Date:
- A4
- Assy:
- Time:
- Revision:
- Sheet
- of
- File:

### Library data of the parts
C38_FP C39_FP C40_FP C41_FP = D-101-0007: as C3#1 on sheet PSU; Category: Capacitor; Capacitance: 10 uF; Mounting Technology: Surface Mount; Rated Voltage: 20 V; Status: Production; Technology: Tantalum; Tolerance: 10 %
C46_FP C47_FP C48_FP C49_FP C50_FP C51_FP C52_FP C53_FP C54_FP C55_FP C56_FP C57_FP C58_FP C59_FP C60_FP C85_FP C87_FP C95_FP C97_FP C98_FP C100_FP = D-101-0080: Capacitor, Ceramic, 0.1uF 10% 16V 0402 (1005) X7R; Polarity: Non-Polarized; Category: Capacitor; Dielectric: X7R; Mounting Technology: Surface Mount; Status: Production; Technology: Ceramic
  C46_FP C47_FP C48_FP C49_FP C50_FP C51_FP C52_FP C53_FP C54_FP C55_FP C56_FP C57_FP C58_FP C59_FP C60_FP: Capacitance: 0.1 uF; Rated Voltage: 16 V; Tolerance: 10 %
  C85_FP C87_FP C95_FP C97_FP C98_FP C100_FP: Capacitance: 0.1uF; Rated Voltage: 16V; Tolerance: 10%
C62_FP C63_FP C64_FP C65_FP C68_FP C69_FP C70_FP C71_FP C73_FP C74_FP C79_FP C80_FP C81_FP C84_FP C88_FP C89_FP C91_FP C94_FP C96_FP C99_FP C101_FP = D-101-0077: Capacitor, Ceramic, 10nF 10% 16V 0402 (1005) X7R; Polarity: Non-Polarized; Category: Capacitor; Capacitance: 10 nF; Dielectric: X7R; Mounting Technology: Surface Mount; Rated Voltage: 16 V; Status: Production; Technology: Ceramic; Tolerance: 10 %